# Altium project AtlysAFE.PrjPCB (part 1 of 2)
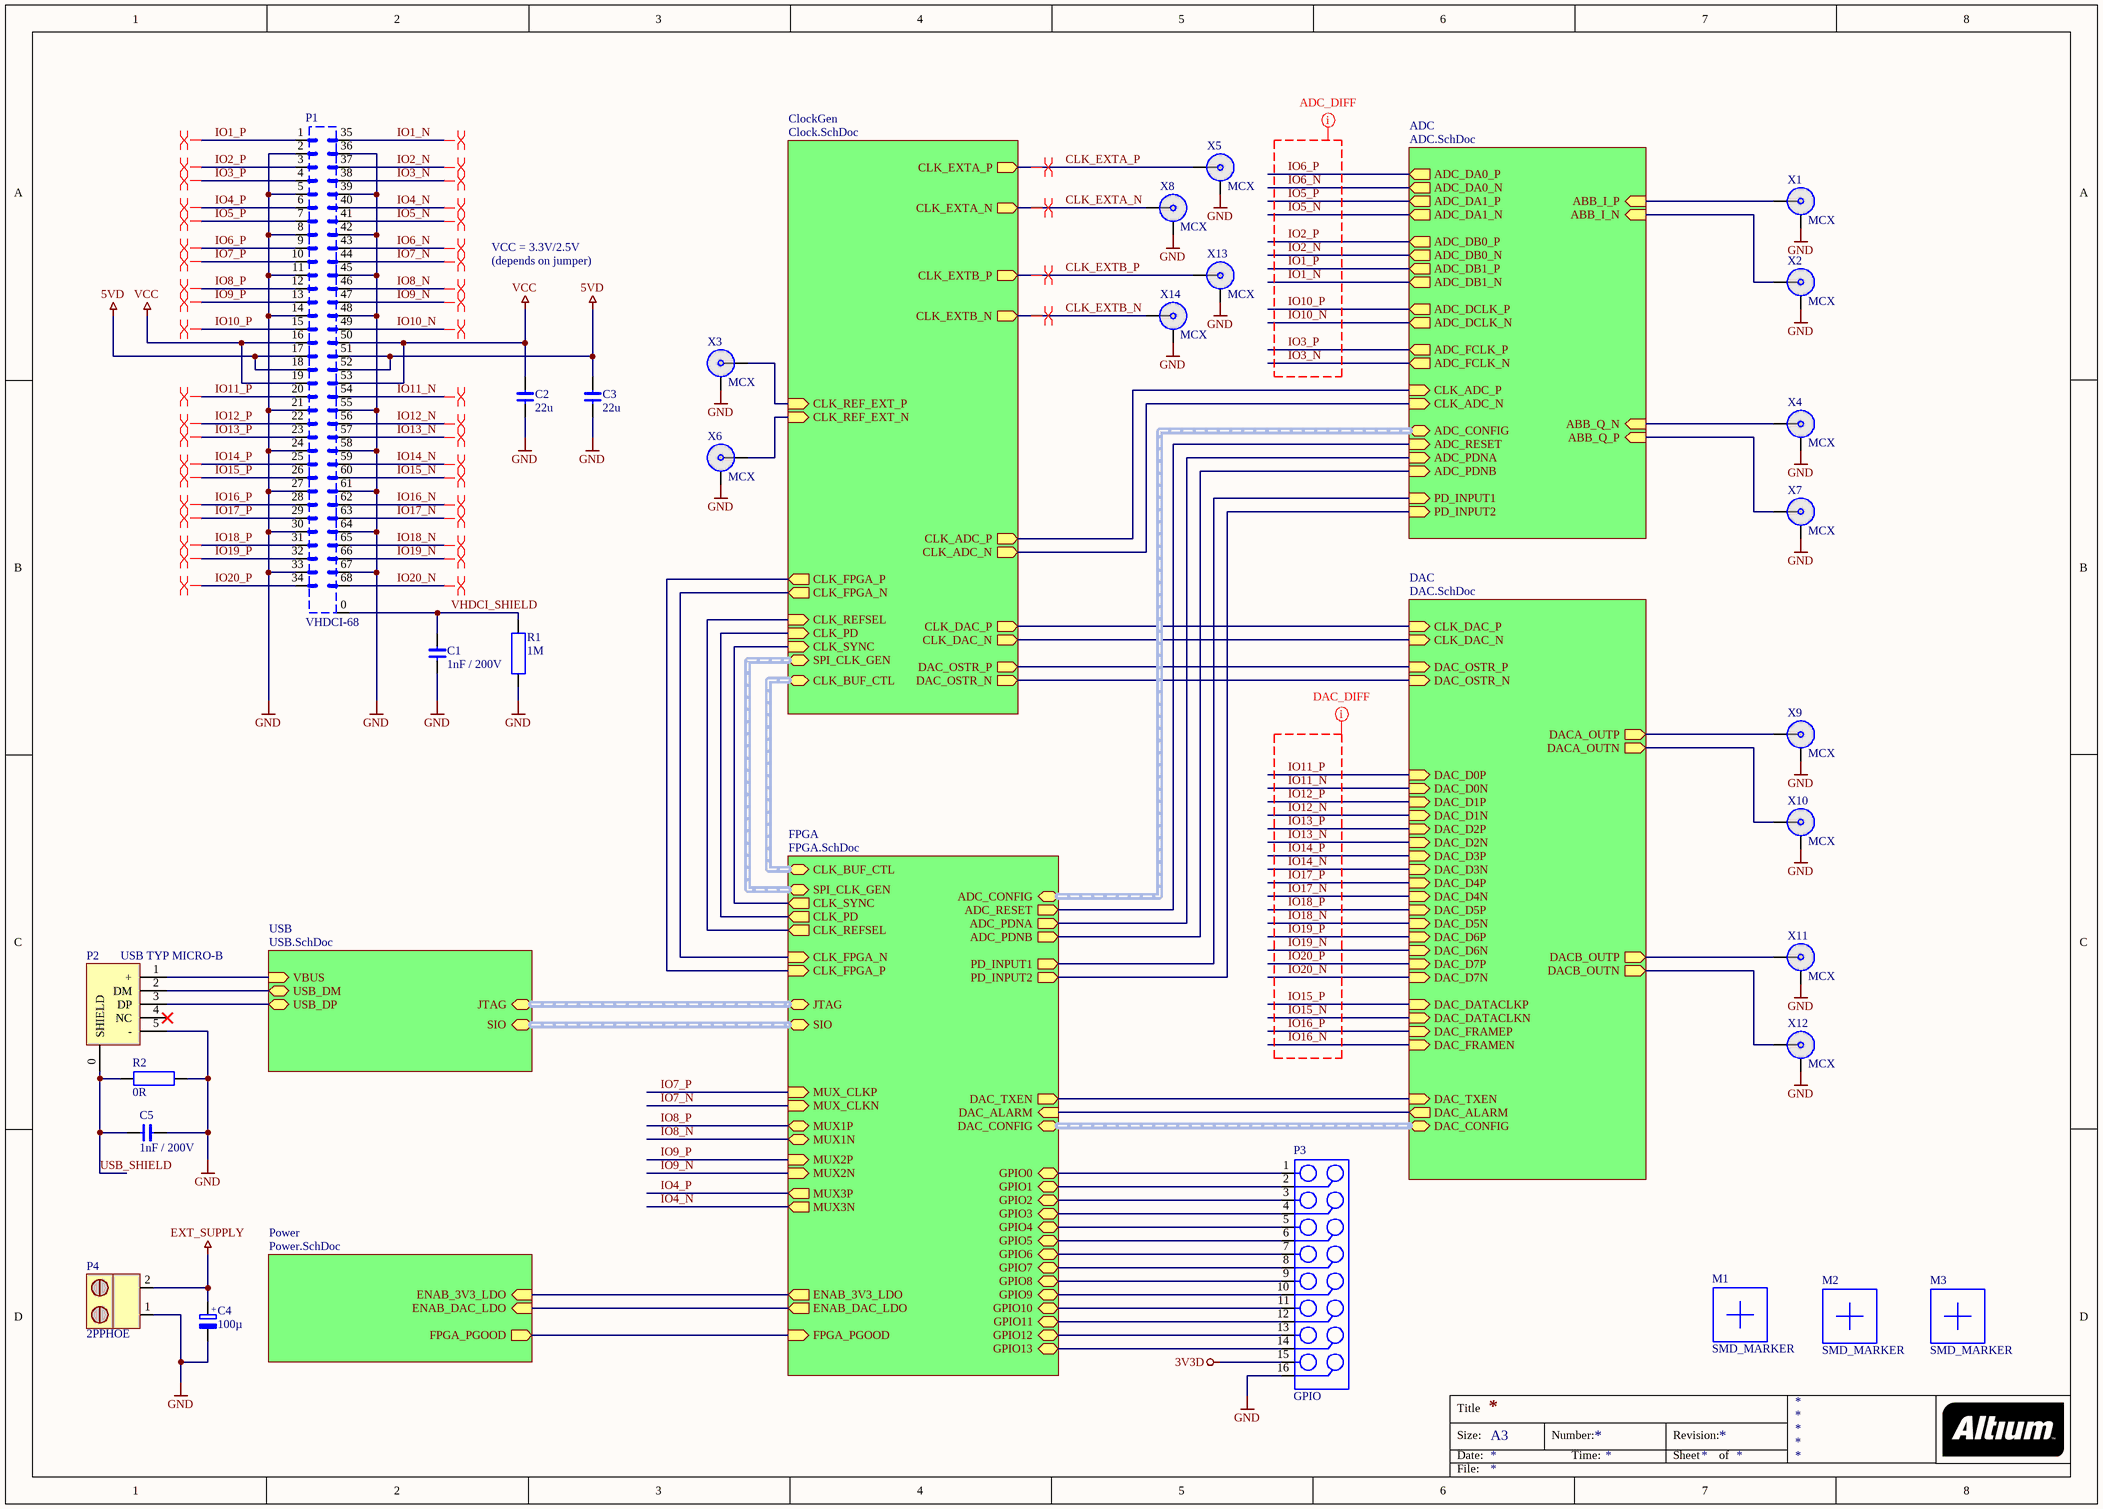
[diagram p0: Main.SchDoc]
8 sheets, 375 parts. Net scope: hierarchical (ports join the sheet entries above them; power ports are global).
Board file: AtlysAFE.PcbDoc
Sheets:
  Main.SchDoc
    ADC = ADC.SchDoc
      ADC_Input = ADC_Input.SchDoc
    DAC = DAC.SchDoc
    FPGA = FPGA.SchDoc
    Power = Power.SchDoc
    USB = USB.SchDoc
    ClockGen = Clock.SchDoc

## Sheet Main.SchDoc
size A3

### Parts
C1  1nF / 200V  [1206]
C2  22u  [1206]
C3  22u  [1206]
C4  100µ  [SMD_ELKO_6.3]
C5  1nF / 200V  [1206]
M1  SMD_MARKER  [SMDMark100 - nopaste]
M2  SMD_MARKER  [SMDMark100 - nopaste]
M3  SMD_MARKER  [SMDMark100 - nopaste]
P1  VHDCI-68  [VHDCI-68_M]
P2  USB TYP MICRO-B  [USB_MICRO_B_SMD_4DIP]
P3  GPIO  [16POL_PF2]
P4  2PPHOE  [2PPHOE]
R1  1M  [1206]
R2  0R  [1206]
X1  MCX  [MCX_TH]
X2  MCX  [MCX_TH]
X3  MCX  [MCX_TH]
X4  MCX  [MCX_TH]
X5  MCX  [MCX_TH]
X6  MCX  [MCX_TH]
X7  MCX  [MCX_TH]
X8  MCX  [MCX_TH]
X9  MCX  [MCX_TH]
X10  MCX  [MCX_TH]
X11  MCX  [MCX_TH]
X12  MCX  [MCX_TH]
X13  MCX  [MCX_TH]
X14  MCX  [MCX_TH]

### Sub-sheets
ADC = ADC.SchDoc: ABB_I_P (in), ABB_I_N (in), ABB_Q_N (in), ABB_Q_P (in), CLK_ADC_P (in), CLK_ADC_N (in), ADC_DA0_P (out), ADC_DA1_P (out), ADC_DB0_P (out), ADC_DB1_P (out), ADC_DCLK_P (out), ADC_FCLK_P (out), ADC_CONFIG (harness SPI3), ADC_RESET (in), ADC_PDNA (in), ADC_PDNB (in), PD_INPUT1 (in), PD_INPUT2 (in), ADC_DA0_N (out), ADC_DA1_N (out), ADC_DB0_N (out), ADC_DB1_N (out), ADC_DCLK_N (out), ADC_FCLK_N (out)
ClockGen = Clock.SchDoc: SPI_CLK_GEN (harness SPI_CLK_GEN), CLK_REFSEL (in), CLK_PD (in), CLK_SYNC (in), CLK_REF_EXT_P (in), CLK_REF_EXT_N (in), CLK_ADC_P (out), CLK_ADC_N (out), CLK_DAC_P (out), CLK_DAC_N (out), DAC_OSTR_P (out), DAC_OSTR_N (out), CLK_FPGA_P (out), CLK_FPGA_N (out), CLK_EXTB_P (out), CLK_EXTB_N (out), CLK_EXTA_P (out), CLK_EXTA_N (out), CLK_BUF_CTL (harness CLK_BUF_CTL)
DAC = DAC.SchDoc: DAC_D0P (in), DAC_D0N (in), DAC_D1P (in), DAC_D1N (in), DAC_D2P (in), DAC_D2N (in), DAC_D3P (in), DAC_D3N (in), DAC_D4P (in), DAC_D4N (in), DAC_D5P (in), DAC_D5N (in), DAC_D6N (in), DAC_D7N (in), DAC_D6P (in), DAC_D7P (in), DAC_DATACLKN (in), DAC_DATACLKP (in), DAC_FRAMEN (in), DAC_FRAMEP (in), DAC_CONFIG (harness SPI3), DAC_TXEN (in), DAC_ALARM (out), DACA_OUTP (out), DACA_OUTN (out), DACB_OUTP (out), DACB_OUTN (out), CLK_DAC_P (in), CLK_DAC_N (in), DAC_OSTR_P (in), DAC_OSTR_N (in)
FPGA = FPGA.SchDoc: JTAG (harness JTAG), SIO (harness Serial IO), ENAB_3V3_LDO (out), FPGA_PGOOD (in), DAC_CONFIG (harness SPI3), DAC_TXEN (out), DAC_ALARM (in), ADC_CONFIG (harness SPI3), ADC_RESET (out), ADC_PDNA (out), ADC_PDNB (out), MUX_CLKP (in), MUX_CLKN (in), MUX2P (in), MUX2N (in), MUX3N (out), MUX3P (out), GPIO0, GPIO1, GPIO2, GPIO3, GPIO4, GPIO5, GPIO6, GPIO7, GPIO8, GPIO9, GPIO10, GPIO11, GPIO12, GPIO13, PD_INPUT1 (out), PD_INPUT2 (out), SPI_CLK_GEN (harness SPI_CLK_GEN), CLK_REFSEL (out), CLK_PD (out), CLK_SYNC (out), CLK_FPGA_P (in), CLK_FPGA_N (in), ENAB_DAC_LDO (out), MUX1N, MUX1P, CLK_BUF_CTL (harness CLK_BUF_CTL)
Power = Power.SchDoc: ENAB_3V3_LDO (in), FPGA_PGOOD (out), ENAB_DAC_LDO (in)
USB = USB.SchDoc: USB_DP (bidir), USB_DM (bidir), JTAG (harness JTAG), SIO (harness Serial IO), VBUS (in)

### Nets
3V3D: P3.15
5VD: C3.1 P1.17 P1.18 P1.51 P1.52
EXT_SUPPLY: C4.1(+) P4.2
GND: C1.2 C2.2 C3.2 C4.2(-) C5.1 P1.2 P1.5 P1.8 P1.11 P1.14 P1.21 P1.24 P1.27 P1.30 P1.33 P1.36 P1.39 P1.42 P1.45 P1.48 P1.55 P1.58 P1.61 P1.64 P1.67 P2.5(-) P3.16 P4.1 R1.2 R2.1 X1.1 X2.1 X3.1 X4.1 X5.1 X6.1 X7.1 X8.1 X9.1 X10.1 X11.1 X12.1 X13.1 X14.1
VCC: C2.1 P1.16 P1.19 P1.50 P1.53
CLK_ADC_N: sheet ADC/CLK_ADC_N, sheet ClockGen/CLK_ADC_N
CLK_ADC_P: sheet ADC/CLK_ADC_P, sheet ClockGen/CLK_ADC_P
CLK_DAC_N: sheet DAC/CLK_DAC_N, sheet ClockGen/CLK_DAC_N
CLK_DAC_P: sheet DAC/CLK_DAC_P, sheet ClockGen/CLK_DAC_P
CLK_EXTA_N: X8.2 ; sheet ClockGen/CLK_EXTA_N
CLK_EXTA_P: X5.2 ; sheet ClockGen/CLK_EXTA_P
CLK_EXTB_N: X14.2 ; sheet ClockGen/CLK_EXTB_N
CLK_EXTB_P: X13.2 ; sheet ClockGen/CLK_EXTB_P
CLK_FPGA_N: sheet FPGA/CLK_FPGA_N, sheet ClockGen/CLK_FPGA_N
CLK_FPGA_P: sheet FPGA/CLK_FPGA_P, sheet ClockGen/CLK_FPGA_P
CLK_REF_EXT_N: X6.2 ; sheet ClockGen/CLK_REF_EXT_N
CLK_REF_EXT_P: X3.2 ; sheet ClockGen/CLK_REF_EXT_P
DAC_OSTR_N: sheet DAC/DAC_OSTR_N, sheet ClockGen/DAC_OSTR_N
DAC_OSTR_P: sheet DAC/DAC_OSTR_P, sheet ClockGen/DAC_OSTR_P
DACA_BIAS_N: X10.2 ; sheet DAC/DACA_OUTN
DACA_BIAS_P: X9.2 ; sheet DAC/DACA_OUTP
DACB_BIAS_N: X12.2 ; sheet DAC/DACB_OUTN
DACB_BIAS_P: X11.2 ; sheet DAC/DACB_OUTP
FPGA_PGOOD: sheet FPGA/FPGA_PGOOD, sheet Power/FPGA_PGOOD
IO1_N: P1.35 ; sheet ADC/ADC_DB1_N
IO1_P: P1.1 ; sheet ADC/ADC_DB1_P
IO2_N: P1.37 ; sheet ADC/ADC_DB0_N
IO2_P: P1.3 ; sheet ADC/ADC_DB0_P
IO3_N: P1.38 ; sheet ADC/ADC_FCLK_N
IO3_P: P1.4 ; sheet ADC/ADC_FCLK_P
IO4_N: P1.40 ; sheet FPGA/MUX3N
IO4_P: P1.6 ; sheet FPGA/MUX3P
IO5_N: P1.41 ; sheet ADC/ADC_DA1_N
IO5_P: P1.7 ; sheet ADC/ADC_DA1_P
IO6_N: P1.43 ; sheet ADC/ADC_DA0_N
IO6_P: P1.9 ; sheet ADC/ADC_DA0_P
IO7_N: P1.44 ; sheet FPGA/MUX_CLKN
IO7_P: P1.10 ; sheet FPGA/MUX_CLKP
IO8_N: P1.46 ; sheet FPGA/MUX1N
IO8_P: P1.12 ; sheet FPGA/MUX1P
IO9_N: P1.47 ; sheet FPGA/MUX2N
IO9_P: P1.13 ; sheet FPGA/MUX2P
IO10_N: P1.49 ; sheet ADC/ADC_DCLK_N
IO10_P: P1.15 ; sheet ADC/ADC_DCLK_P
IO11_N: P1.54 ; sheet DAC/DAC_D0N
IO11_P: P1.20 ; sheet DAC/DAC_D0P
IO12_N: P1.56 ; sheet DAC/DAC_D1N
IO12_P: P1.22 ; sheet DAC/DAC_D1P
IO13_N: P1.57 ; sheet DAC/DAC_D2N
IO13_P: P1.23 ; sheet DAC/DAC_D2P
IO14_N: P1.59 ; sheet DAC/DAC_D3N
IO14_P: P1.25 ; sheet DAC/DAC_D3P
IO15_N: P1.60 ; sheet DAC/DAC_DATACLKN
IO15_P: P1.26 ; sheet DAC/DAC_DATACLKP
IO16_N: P1.62 ; sheet DAC/DAC_FRAMEN
IO16_P: P1.28 ; sheet DAC/DAC_FRAMEP
IO17_N: P1.63 ; sheet DAC/DAC_D4N
IO17_P: P1.29 ; sheet DAC/DAC_D4P
IO18_N: P1.65 ; sheet DAC/DAC_D5N
IO18_P: P1.31 ; sheet DAC/DAC_D5P
IO19_N: P1.66 ; sheet DAC/DAC_D6N
IO19_P: P1.32 ; sheet DAC/DAC_D6P
IO20_N: P1.68 ; sheet DAC/DAC_D7N
IO20_P: P1.34 ; sheet DAC/DAC_D7P
USB_D_N: P2.2(DM) ; sheet USB/USB_DM
USB_D_P: P2.3(DP) ; sheet USB/USB_DP
USB_SHIELD: C5.2 P2.0(SHIELD) R2.2
USB_VBUS: P2.1(+) ; sheet USB/VBUS
VHDCI_SHIELD: C1.1 P1.0(SHIELD) R1.1
NetIC100_4: sheet ADC/ADC_RESET, sheet FPGA/ADC_RESET
NetIC100_30: sheet ADC/ADC_PDNB, sheet FPGA/ADC_PDNB
NetIC100_31: sheet ADC/ADC_PDNA, sheet FPGA/ADC_PDNA
NetIC200_12: sheet ADC/PD_INPUT1, sheet FPGA/PD_INPUT1
NetIC201_12: sheet ADC/PD_INPUT2, sheet FPGA/PD_INPUT2
NetIC300_30: sheet DAC/DAC_TXEN, sheet FPGA/DAC_TXEN
NetIC400_13: sheet DAC/DAC_ALARM, sheet FPGA/DAC_ALARM
NetIC400_29: sheet FPGA/CLK_SYNC, sheet ClockGen/CLK_SYNC
NetIC400_30: sheet FPGA/CLK_REFSEL, sheet ClockGen/CLK_REFSEL
NetIC400_31: sheet FPGA/CLK_PD, sheet ClockGen/CLK_PD
NetIC400_51: P3.14 ; sheet FPGA/GPIO13
NetIC400_52: P3.13 ; sheet FPGA/GPIO12
NetIC400_53: P3.12 ; sheet FPGA/GPIO11
NetIC400_54: P3.11 ; sheet FPGA/GPIO10
NetIC400_57: P3.10 ; sheet FPGA/GPIO9
NetIC400_58: P3.9 ; sheet FPGA/GPIO8
NetIC400_59: P3.8 ; sheet FPGA/GPIO7
NetIC400_60: P3.7 ; sheet FPGA/GPIO6
NetIC400_62: P3.6 ; sheet FPGA/GPIO5
NetIC400_63: P3.5 ; sheet FPGA/GPIO4
NetIC400_64: P3.4 ; sheet FPGA/GPIO3
NetIC400_65: P3.3 ; sheet FPGA/GPIO2
NetIC400_66: P3.2 ; sheet FPGA/GPIO1
NetIC400_67: P3.1 ; sheet FPGA/GPIO0
NetIC400_71: sheet FPGA/ENAB_DAC_LDO, sheet Power/ENAB_DAC_LDO
NetIC400_75: sheet FPGA/ENAB_3V3_LDO, sheet Power/ENAB_3V3_LDO
NetR203_1: X1.2 ; sheet ADC/ABB_I_P
NetR207_1: X2.2 ; sheet ADC/ABB_I_N
NetR218_1: X7.2 ; sheet ADC/ABB_Q_P
NetR222_1: X4.2 ; sheet ADC/ABB_Q_N

Not connected (* = marked no-connect by the designer): P2 4(NC)*

### Buses and harness runs
harness sheet ADC/ADC_CONFIG = sheet FPGA/ADC_CONFIG
harness sheet ClockGen/CLK_BUF_CTL = sheet FPGA/CLK_BUF_CTL
harness sheet ClockGen/SPI_CLK_GEN = sheet FPGA/SPI_CLK_GEN
harness sheet DAC/DAC_CONFIG = sheet FPGA/DAC_CONFIG
harness sheet FPGA/JTAG = sheet USB/JTAG
harness sheet FPGA/SIO = sheet USB/SIO

### Layout directives
differential pair: CLK_EXTA_N, CLK_EXTA_P, CLK_EXTB_N, CLK_EXTB_P, IO1_N, IO1_P, IO2_N, IO2_P, IO3_N, IO3_P, IO4_N, IO4_P, IO5_N, IO5_P, IO6_N, IO6_P, IO7_N, IO7_P, IO8_N, IO8_P, IO9_N, IO9_P, IO10_N, IO10_P, IO11_N, IO11_P, IO12_N, IO12_P, IO13_N, IO13_P, IO14_N, IO14_P, IO15_N, IO15_P, IO16_N, IO16_P, IO17_N, IO17_P, IO18_N, IO18_P, IO19_N, IO19_P, IO20_N, IO20_P
net class DAC_DIFF: IO11_N, IO11_P, IO12_N, IO12_P, IO13_N, IO13_P, IO14_N, IO14_P, IO15_N, IO15_P, IO16_N, IO16_P, IO17_N, IO17_P, IO18_N, IO18_P, IO19_N, IO19_P, IO20_N, IO20_P
net class ADC_DIFF: IO1_N, IO1_P, IO2_N, IO2_P, IO3_N, IO3_P, IO5_N, IO5_P, IO6_N, IO6_P, IO10_N, IO10_P

### Notes on the sheet
- VCC = 3.3V/2.5V
- (depends on jumper)
- Title
- Size:
- Date:
- A3
- Number:
- Time:
- Revision:
- Sheet
- of
- File:

### Library data of the parts
C1-C3 C5 = C
C4 = ELCO: EEH-ZA1E101XP
M1-M3 = SMD_MARKER: SMD MARKER
P1 = MALE_VHDCI-68: 68-Pin VHDCI Connector
P2 = USB TYP MICRO-B: 10118194-0001LF
P3 = 16POLPF
P4 = 2PPHOE: Steckbare Scharubklemme 2pol.
R1 R2 = R
X1-X14 = MCX: MCX Connector

## Sheet ADC.SchDoc
size A3
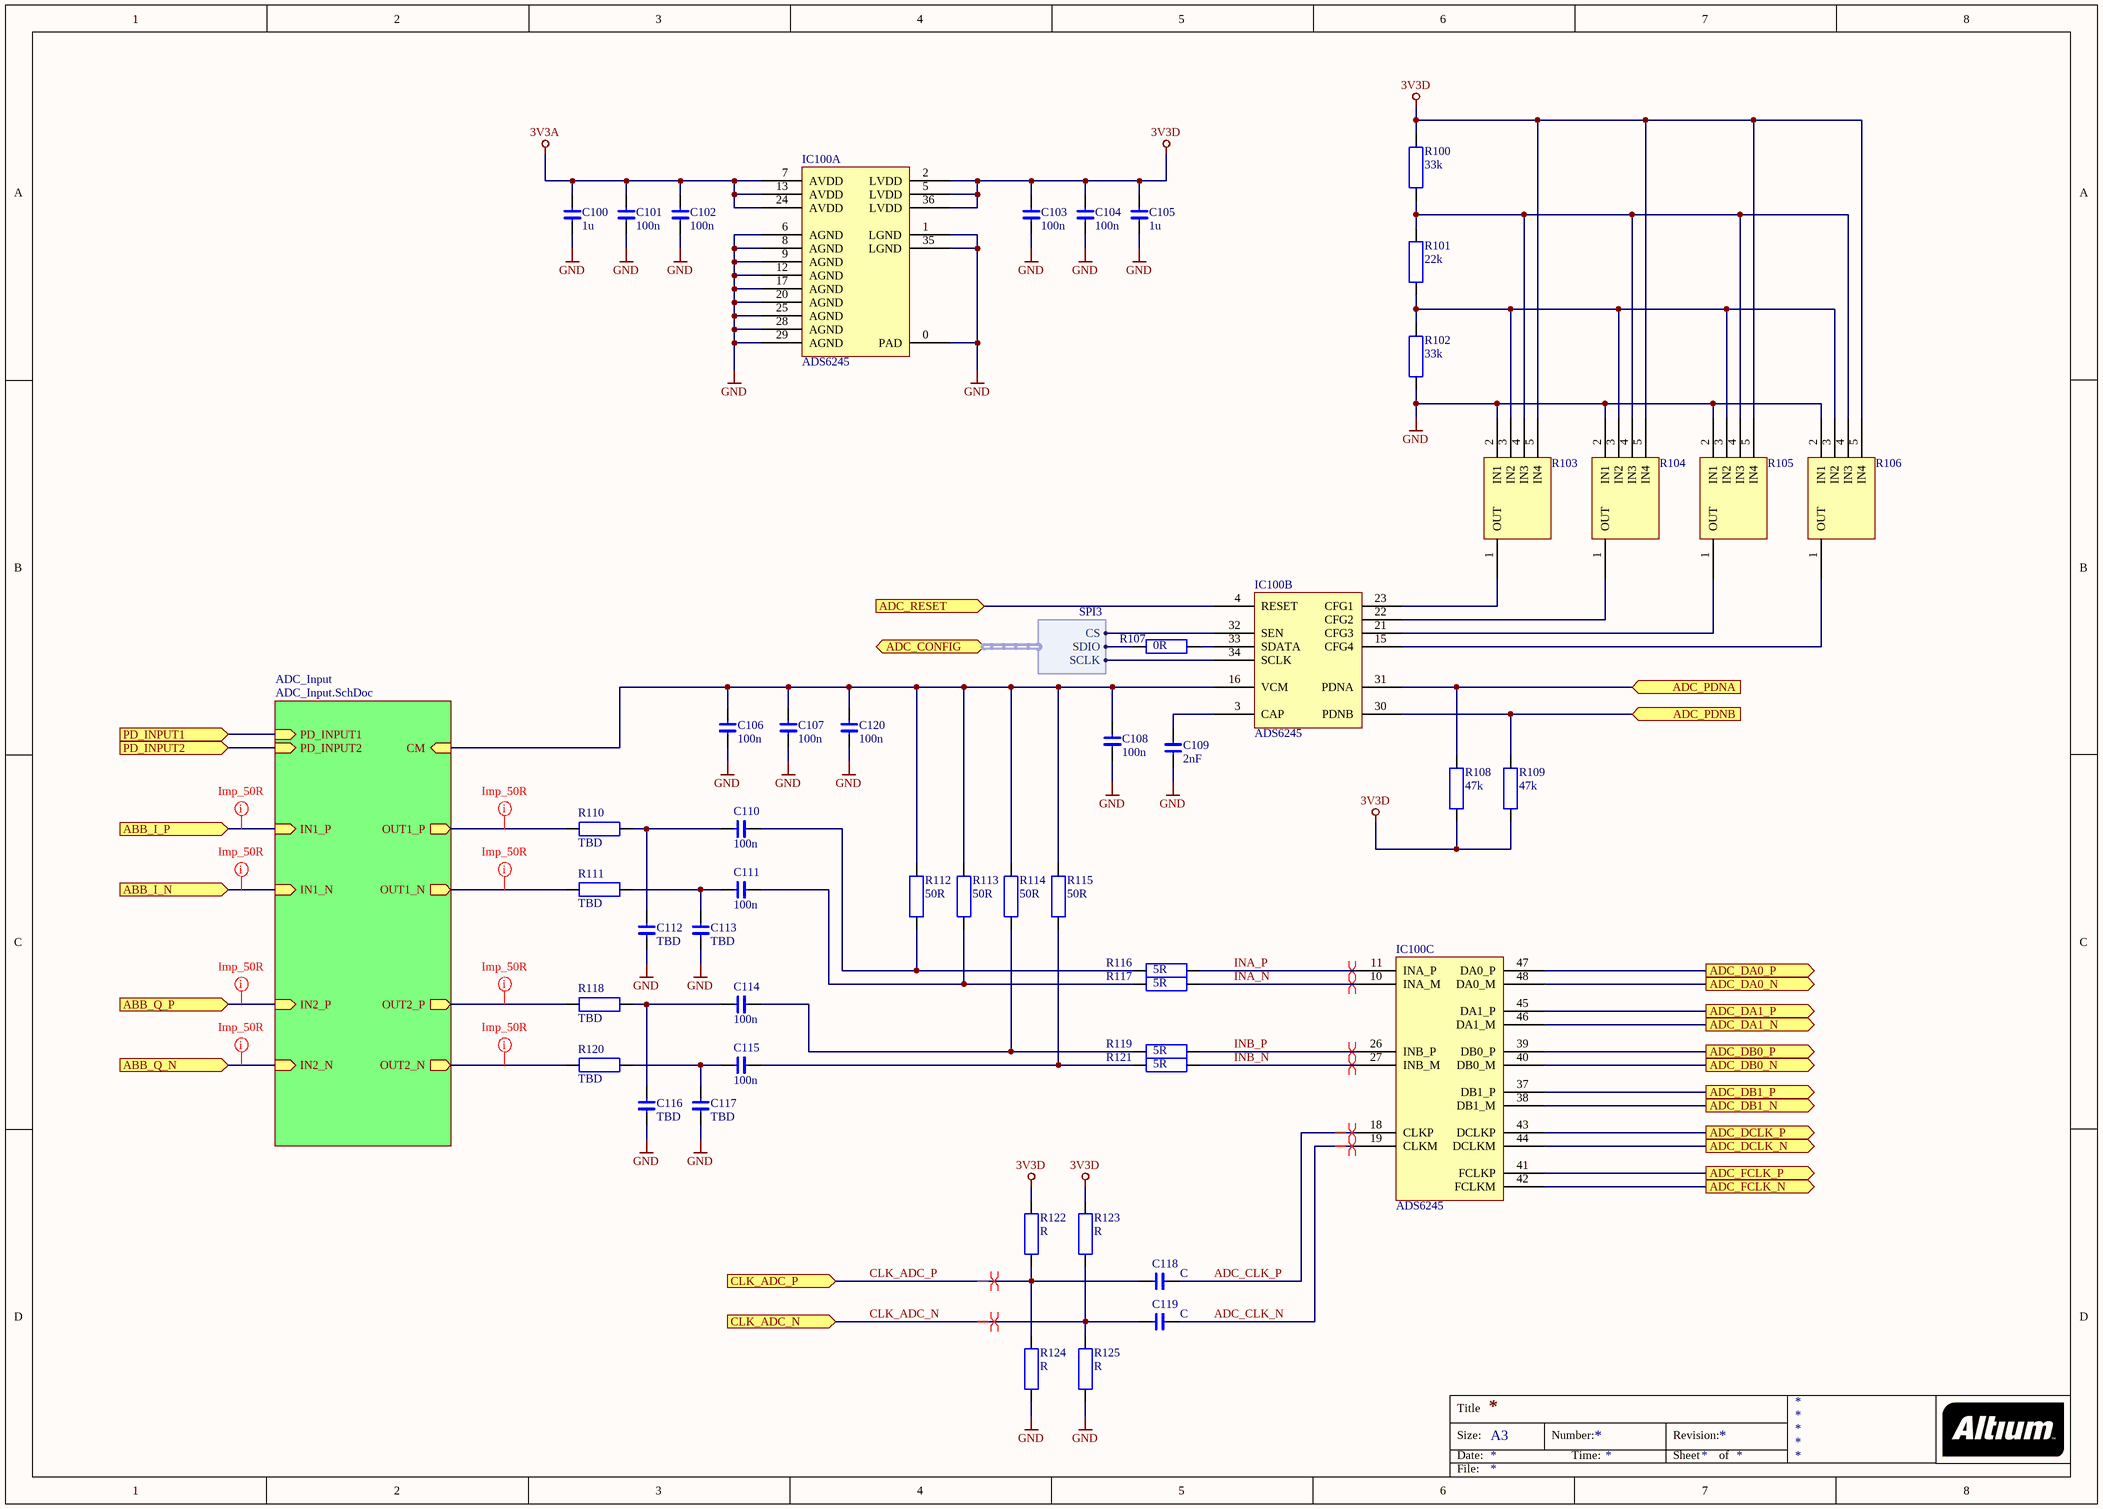
[diagram p1: ADC.SchDoc]

### Parts
C100  1u  [0603 SMALL OUTLINE]
C101  100n  [0603 SMALL OUTLINE]
C102  100n  [0603 SMALL OUTLINE]
C103  100n  [0603 SMALL OUTLINE]
C104  100n  [0603 SMALL OUTLINE]
C105  1u  [0603 SMALL OUTLINE]
C106  100n  [0603 SMALL OUTLINE]
C107  100n  [0603 SMALL OUTLINE]
C108  100n  [0603 SMALL OUTLINE]
C109  2nF  [0603 SMALL OUTLINE]
C110  100n  [0603 SMALL OUTLINE]
C111  100n  [0603 SMALL OUTLINE]
C112  TBD  [0603 SMALL OUTLINE]
C113  TBD  [0603 SMALL OUTLINE]
C114  100n  [0603 SMALL OUTLINE]
C115  100n  [0603 SMALL OUTLINE]
C116  TBD  [0603 SMALL OUTLINE]
C117  TBD  [0603 SMALL OUTLINE]
C118  C  [0603 SMALL OUTLINE]
C119  C  [0603 SMALL OUTLINE]
C120  100n  [0603 SMALL OUTLINE]
IC100  ADS6245  [VQFN48_LONG]  (parts A,B,C of 3)
R100  33k  [0603 SMALL OUTLINE]
R101  22k  [0603 SMALL OUTLINE]
R102  33k  [0603 SMALL OUTLINE]
R103  0603_MUX4  [0603_MUX4]  (value not drawn)
R104  0603_MUX4  [0603_MUX4]  (value not drawn)
R105  0603_MUX4  [0603_MUX4]  (value not drawn)
R106  0603_MUX4  [0603_MUX4]  (value not drawn)
R107  0R  [0603 SMALL OUTLINE]
R108  47k  [0603 SMALL OUTLINE]
R109  47k  [0603 SMALL OUTLINE]
R110  TBD  [0603 SMALL OUTLINE]
R111  TBD  [0603 SMALL OUTLINE]
R112  50R  [0603 SMALL OUTLINE]
R113  50R  [0603 SMALL OUTLINE]
R114  50R  [0603 SMALL OUTLINE]
R115  50R  [0603 SMALL OUTLINE]
R116  5R  [0603 SMALL OUTLINE]
R117  5R  [0603 SMALL OUTLINE]
R118  TBD  [0603 SMALL OUTLINE]
R119  5R  [0603 SMALL OUTLINE]
R120  TBD  [0603 SMALL OUTLINE]
R121  5R  [0603 SMALL OUTLINE]
R122  R  [0603 SMALL OUTLINE]
R123  R  [0603 SMALL OUTLINE]
R124  R  [0603 SMALL OUTLINE]
R125  R  [0603 SMALL OUTLINE]

### Sub-sheets
ADC_Input = ADC_Input.SchDoc: CM (in), IN1_P (in), IN1_N (in), OUT1_P (out), OUT1_N (out), IN2_P (in), IN2_N (in), OUT2_P (out), OUT2_N (out), PD_INPUT1 (in), PD_INPUT2 (in)

### Ports
ABB_I_N (in), ABB_I_P (in), ABB_Q_N (in), ABB_Q_P (in), ADC_CONFIG (harness SPI3), ADC_DA0_N (out), ADC_DA0_P (out), ADC_DA1_N (out), ADC_DA1_P (out), ADC_DB0_N (out), ADC_DB0_P (out), ADC_DB1_N (out), ADC_DB1_P (out), ADC_DCLK_N (out), ADC_DCLK_P (out), ADC_FCLK_N (out), ADC_FCLK_P (out), ADC_PDNA (in), ADC_PDNB (in), ADC_RESET (in), CLK_ADC_N (in), CLK_ADC_P (in), PD_INPUT1 (in), PD_INPUT2 (in)

### Harnesses
SPI3: CS, SCLK, SDIO

### Nets
3V3A: C100.1 C101.1 C102.1 IC100.7(AVDD) IC100.13(AVDD) IC100.24(AVDD)
3V3D: C103.1 C104.1 C105.1 IC100.2(LVDD) IC100.5(LVDD) IC100.36(LVDD) R100.2 R103.5(IN4) R104.5(IN4) R105.5(IN4) R106.5(IN4) R108.1 R109.1 R122.1 R123.1
GND: C100.2 C101.2 C102.2 C103.2 C104.2 C105.2 C106.2 C107.2 C108.2 C109.2 C112.2 C113.2 C116.2 C117.2 C120.2 IC100.0(PAD) IC100.1(LGND) IC100.6(AGND) IC100.8(AGND) IC100.9(AGND) IC100.12(AGND) IC100.17(AGND) IC100.20(AGND) IC100.25(AGND) IC100.28(AGND) IC100.29(AGND) IC100.35(LGND) R102.1 R103.2(IN1) R104.2(IN1) R105.2(IN1) R106.2(IN1) R124.2 R125.2
ADC_CLK_N: C119.2 IC100.19(CLKM)
ADC_CLK_P: C118.2 IC100.18(CLKP)
CLK_ADC_N: C119.1 R123.2 R125.1 ; port CLK_ADC_N
CLK_ADC_P: C118.1 R122.2 R124.1 ; port CLK_ADC_P
INA_N: IC100.10(INA_M) R117.2
INA_P: IC100.11(INA_P) R116.2
INB_N: IC100.27(INB_M) R121.2
INB_P: IC100.26(INB_P) R119.2
IO1_N: IC100.38(DB1_M) ; port ADC_DB1_N
IO1_P: IC100.37(DB1_P) ; port ADC_DB1_P
IO2_N: IC100.40(DB0_M) ; port ADC_DB0_N
IO2_P: IC100.39(DB0_P) ; port ADC_DB0_P
IO3_N: IC100.42(FCLKM) ; port ADC_FCLK_N
IO3_P: IC100.41(FCLKP) ; port ADC_FCLK_P
IO5_N: IC100.46(DA1_M) ; port ADC_DA1_N
IO5_P: IC100.45(DA1_P) ; port ADC_DA1_P
IO6_N: IC100.48(DA0_M) ; port ADC_DA0_N
IO6_P: IC100.47(DA0_P) ; port ADC_DA0_P
IO10_N: IC100.44(DCLKM) ; port ADC_DCLK_N
IO10_P: IC100.43(DCLKP) ; port ADC_DCLK_P
NetC106_1: C106.1 C107.1 C108.1 C120.1 IC100.16(VCM) R112.1 R113.1 R114.1 R115.1 ; sheet ADC_Input/CM
NetC109_1: C109.1 IC100.3(CAP)
NetC110_1: C110.1 R112.2 R116.1
NetC110_2: C110.2 C112.1 R110.1
NetC111_1: C111.1 R113.2 R117.1
NetC111_2: C111.2 C113.1 R111.1
NetC114_1: C114.1 R114.2 R119.1
NetC114_2: C114.2 C116.1 R118.1
NetC115_1: C115.1 R115.2 R121.1
NetC115_2: C115.2 C117.1 R120.1
NetIC100_4: IC100.4(RESET) ; port ADC_RESET
NetIC100_15: IC100.15(CFG4) R106.1(OUT)
NetIC100_21: IC100.21(CFG3) R105.1(OUT)
NetIC100_22: IC100.22(CFG2) R104.1(OUT)
NetIC100_23: IC100.23(CFG1) R103.1(OUT)
NetIC100_30: IC100.30(PDNB) R109.2 ; port ADC_PDNB
NetIC100_31: IC100.31(PDNA) R108.2 ; port ADC_PDNA
NetIC100_32: IC100.32(SEN) ; port ADC_CONFIG.CS
NetIC100_33: IC100.33(SDATA) R107.2
NetIC100_34: IC100.34(SCLK) ; port ADC_CONFIG.SCLK
NetIC200_3: R110.2 ; sheet ADC_Input/OUT1_P
NetIC200_10: R111.2 ; sheet ADC_Input/OUT1_N
NetIC200_12: port PD_INPUT1, sheet ADC_Input/PD_INPUT1
NetIC201_3: R118.2 ; sheet ADC_Input/OUT2_P
NetIC201_10: R120.2 ; sheet ADC_Input/OUT2_N
NetIC201_12: port PD_INPUT2, sheet ADC_Input/PD_INPUT2
NetIC400_19: R107.1 ; port ADC_CONFIG.SDIO
NetR100_1: R100.1 R101.2 R103.4(IN3) R104.4(IN3) R105.4(IN3) R106.4(IN3)
NetR101_1: R101.1 R102.2 R103.3(IN2) R104.3(IN2) R105.3(IN2) R106.3(IN2)
NetR203_1: port ABB_I_P, sheet ADC_Input/IN1_P
NetR207_1: port ABB_I_N, sheet ADC_Input/IN1_N
NetR218_1: port ABB_Q_P, sheet ADC_Input/IN2_P
NetR222_1: port ABB_Q_N, sheet ADC_Input/IN2_N

### Layout directives
differential pair: ADC_CLK_N, ADC_CLK_P, CLK_ADC_N, CLK_ADC_P, INA_N, INA_P, INB_N, INB_P
net class Imp_50R: NetIC200_3, NetIC200_10, NetIC201_3, NetIC201_10, NetR203_1, NetR207_1, NetR218_1, NetR222_1

### Notes on the sheet
- Title
- Size:
- Date:
- A3
- Number:
- Time:
- Revision:
- Sheet
- of
- File:

### Library data of the parts
C100-C117 C120 = C
IC100 = ADS6245_2WIRE: DUAL CHANNEL, 14-BIT, 125/105/80/65 MSPS ADC WITH SERIAL LVDS OUTPUTS
R100-R102 R107-R121 = R

## Sheet ADC_Input.SchDoc
size A3
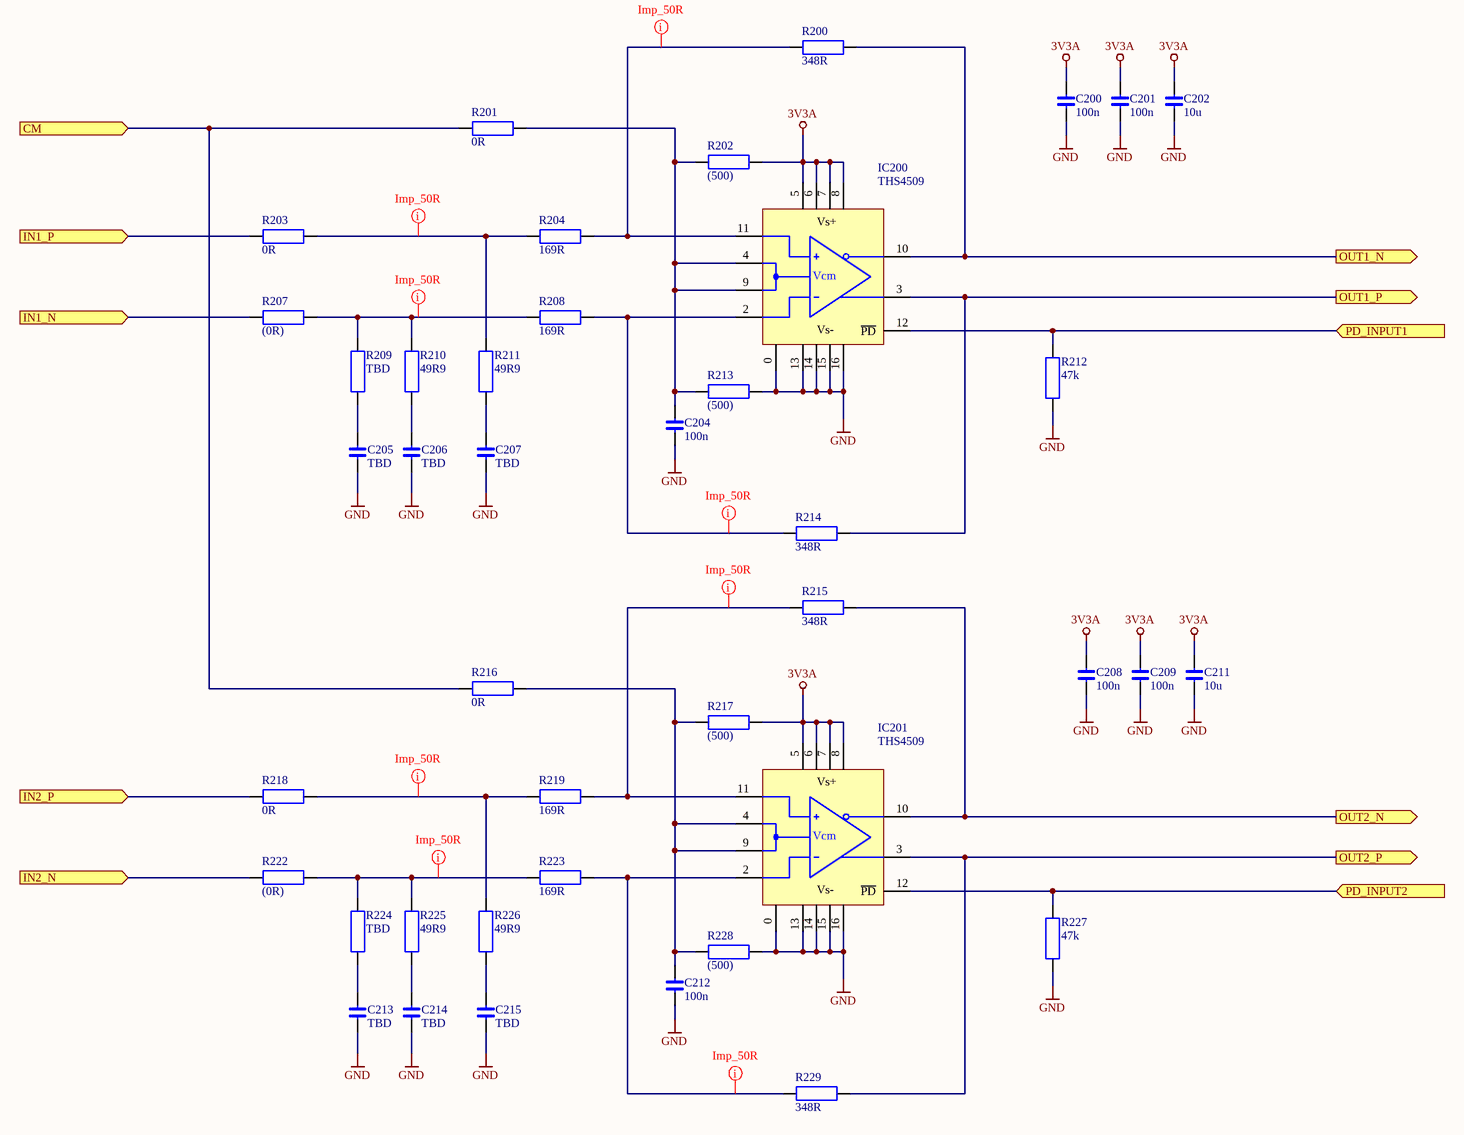
[diagram p2: ADC_Input.SchDoc]

### Parts
C200  100n  [0603 SMALL OUTLINE]
C201  100n  [0603 SMALL OUTLINE]
C202  10u  [0805 SMALL OUTLINE]
C204  100n  [0603 SMALL OUTLINE]
C205  TBD  [0603 SMALL OUTLINE]
C206  TBD  [0603 SMALL OUTLINE]
C207  TBD  [0603 SMALL OUTLINE]
C208  100n  [0603 SMALL OUTLINE]
C209  100n  [0603 SMALL OUTLINE]
C211  10u  [0805 SMALL OUTLINE]
C212  100n  [0603 SMALL OUTLINE]
C213  TBD  [0603 SMALL OUTLINE]
C214  TBD  [0603 SMALL OUTLINE]
C215  TBD  [0603 SMALL OUTLINE]
IC200  THS4509  [QFN16_LONG]
IC201  THS4509  [QFN16_LONG]
R200  348R  [0603 SMALL OUTLINE]
R201  0R  [0603 SMALL OUTLINE]
R202  (500)  [0603 SMALL OUTLINE]
R203  0R  [0603 SMALL OUTLINE]
R204  169R  [0603 SMALL OUTLINE]
R207  (0R)  [0603 SMALL OUTLINE]
R208  169R  [0603 SMALL OUTLINE]
R209  TBD  [0603 SMALL OUTLINE]
R210  49R9  [0603 SMALL OUTLINE]
R211  49R9  [0603 SMALL OUTLINE]
R212  47k  [0603 SMALL OUTLINE]
R213  (500)  [0603 SMALL OUTLINE]
R214  348R  [0603 SMALL OUTLINE]
R215  348R  [0603 SMALL OUTLINE]
R216  0R  [0603 SMALL OUTLINE]
R217  (500)  [0603 SMALL OUTLINE]
R218  0R  [0603 SMALL OUTLINE]
R219  169R  [0603 SMALL OUTLINE]
R222  (0R)  [0603 SMALL OUTLINE]
R223  169R  [0603 SMALL OUTLINE]
R224  TBD  [0603 SMALL OUTLINE]
R225  49R9  [0603 SMALL OUTLINE]
R226  49R9  [0603 SMALL OUTLINE]
R227  47k  [0603 SMALL OUTLINE]
R228  (500)  [0603 SMALL OUTLINE]
R229  348R  [0603 SMALL OUTLINE]

### Ports
CM (in), IN1_N (in), IN1_P (in), IN2_N (in), IN2_P (in), OUT1_N (out), OUT1_P (out), OUT2_N (out), OUT2_P (out), PD_INPUT1 (in), PD_INPUT2 (in)

### Nets
3V3A: C200.1 C201.1 C202.1 C208.1 C209.1 C211.1 IC200.5(Vs+) IC200.6(Vs+) IC200.7(Vs+) IC200.8(Vs+) IC201.5(Vs+) IC201.6(Vs+) IC201.7(Vs+) IC201.8(Vs+) R202.1 R217.1
GND: C200.2 C201.2 C202.2 C204.2 C205.2 C206.2 C207.2 C208.2 C209.2 C211.2 C212.2 C213.2 C214.2 C215.2 IC200.0(PAD) IC200.13(Vs-) IC200.14(Vs-) IC200.15(Vs-) IC200.16(Vs-) IC201.0(PAD) IC201.13(Vs-) IC201.14(Vs-) IC201.15(Vs-) IC201.16(Vs-) R212.1 R213.1 R227.1 R228.1
NetC106_1: R201.1 R216.1 ; port CM
NetC204_1: C204.1 IC200.4(CM) IC200.9(CM) R201.2 R202.2 R213.2
NetC205_1: C205.1 R209.1
NetC206_1: C206.1 R210.1
NetC207_1: C207.1 R211.1
NetC212_1: C212.1 IC201.4(CM) IC201.9(CM) R216.2 R217.2 R228.2
NetC213_1: C213.1 R224.1
NetC214_1: C214.1 R225.1
NetC215_1: C215.1 R226.1
NetIC200_2: IC200.2(-IN) R208.1 R214.2
NetIC200_3: IC200.3(+OUT) R214.1 ; port OUT1_P
NetIC200_10: IC200.10(-OUT) R200.1 ; port OUT1_N
NetIC200_11: IC200.11(+IN) R200.2 R204.1
NetIC200_12: IC200.12(~{PD}) R212.2 ; port PD_INPUT1
NetIC201_2: IC201.2(-IN) R223.1 R229.2
NetIC201_3: IC201.3(+OUT) R229.1 ; port OUT2_P
NetIC201_10: IC201.10(-OUT) R215.1 ; port OUT2_N
NetIC201_11: IC201.11(+IN) R215.2 R219.1
NetIC201_12: IC201.12(~{PD}) R227.2 ; port PD_INPUT2
NetR203_1: R203.1 ; port IN1_P
NetR203_2: R203.2 R204.2 R211.2
NetR207_1: R207.1 ; port IN1_N
NetR207_2: R207.2 R208.2 R209.2 R210.2
NetR218_1: R218.1 ; port IN2_P
NetR218_2: R218.2 R219.2 R226.2
NetR222_1: R222.1 ; port IN2_N
NetR222_2: R222.2 R223.2 R224.2 R225.2

### Layout directives
net class Imp_50R: NetIC200_2, NetIC200_11, NetIC201_2, NetIC201_11, NetR203_2, NetR207_2, NetR218_2, NetR222_2

### Notes on the sheet
- Title
- Size:
- Date:
- A3
- Number:
- Time:
- Revision:
- Sheet
- of
- File:
- (in symbol THS4509) Vcm

### Library data of the parts
C200-C202 C204-C209 C211-C215 = C
IC200 IC201 = THS4509: WIDEBAND, LOW-NOISE, LOW-DISTORTION, FULLY-DIFFERENTIAL AMPLIFIER
R200-R204 R207-R219 R222-R229 = R

## Sheet DAC.SchDoc
size A3
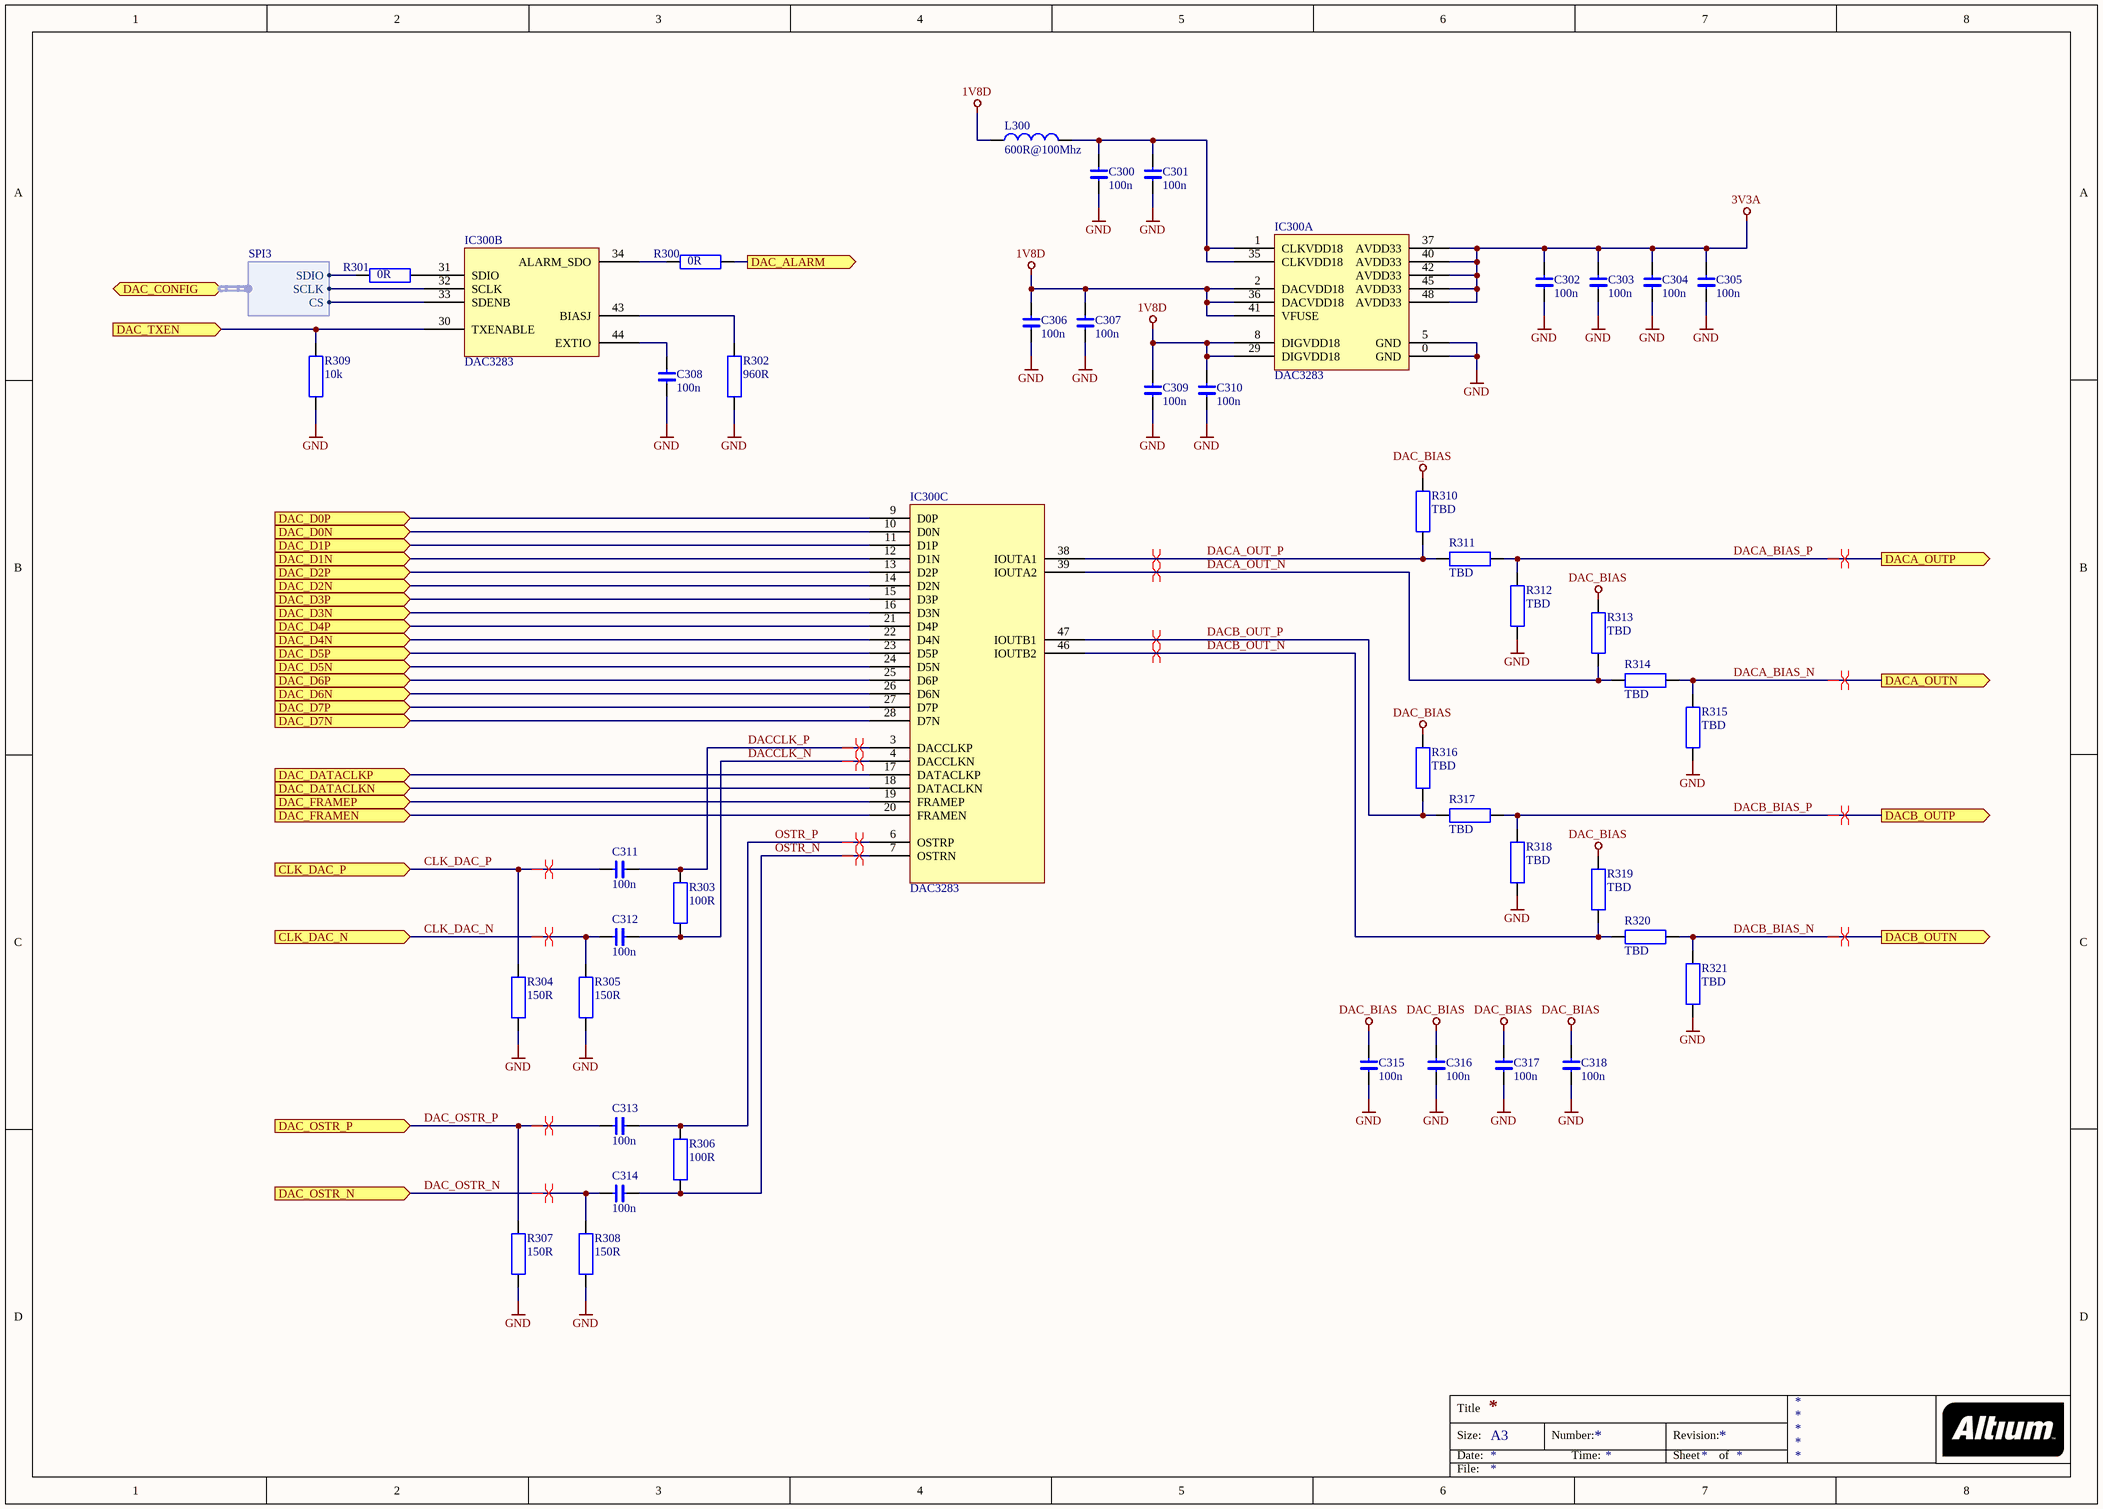
[diagram p3: DAC.SchDoc]

### Parts
C300  100n  [0603 SMALL OUTLINE]
C301  100n  [0603 SMALL OUTLINE]
C302  100n  [0603 SMALL OUTLINE]
C303  100n  [0603 SMALL OUTLINE]
C304  100n  [0603 SMALL OUTLINE]
C305  100n  [0603 SMALL OUTLINE]
C306  100n  [0603 SMALL OUTLINE]
C307  100n  [0603 SMALL OUTLINE]
C308  100n  [0603 SMALL OUTLINE]
C309  100n  [0603 SMALL OUTLINE]
C310  100n  [0603 SMALL OUTLINE]
C311  100n  [0603 SMALL OUTLINE]
C312  100n  [0603 SMALL OUTLINE]
C313  100n  [0603 SMALL OUTLINE]
C314  100n  [0603 SMALL OUTLINE]
C315  100n  [0603 SMALL OUTLINE]
C316  100n  [0603 SMALL OUTLINE]
C317  100n  [0603 SMALL OUTLINE]
C318  100n  [0603 SMALL OUTLINE]
IC300  DAC3283  [VQFN48_LONG]  (parts A,B,C of 3)
L300  600R@100Mhz  [0805]
R300  0R  [0603 SMALL OUTLINE]
R301  0R  [0603 SMALL OUTLINE]
R302  960R  [0603 SMALL OUTLINE]
R303  100R  [0603 SMALL OUTLINE]
R304  150R  [0603 SMALL OUTLINE]
R305  150R  [0603 SMALL OUTLINE]
R306  100R  [0603 SMALL OUTLINE]
R307  150R  [0603 SMALL OUTLINE]
R308  150R  [0603 SMALL OUTLINE]
R309  10k  [0603 SMALL OUTLINE]
R310  TBD  [0603 SMALL OUTLINE]
R311  TBD  [0603 SMALL OUTLINE]
R312  TBD  [0603 SMALL OUTLINE]
R313  TBD  [0603 SMALL OUTLINE]
R314  TBD  [0603 SMALL OUTLINE]
R315  TBD  [0603 SMALL OUTLINE]
R316  TBD  [0603 SMALL OUTLINE]
R317  TBD  [0603 SMALL OUTLINE]
R318  TBD  [0603 SMALL OUTLINE]
R319  TBD  [0603 SMALL OUTLINE]
R320  TBD  [0603 SMALL OUTLINE]
R321  TBD  [0603 SMALL OUTLINE]

### Ports
CLK_DAC_N (in), CLK_DAC_P (in), DAC_ALARM (out), DAC_CONFIG (harness SPI3), DAC_D0N (in), DAC_D0P (in), DAC_D1N (in), DAC_D1P (in), DAC_D2N (in), DAC_D2P (in), DAC_D3N (in), DAC_D3P (in), DAC_D4N (in), DAC_D4P (in), DAC_D5N (in), DAC_D5P (in), DAC_D6N (in), DAC_D6P (in), DAC_D7N (in), DAC_D7P (in), DAC_DATACLKN (in), DAC_DATACLKP (in), DAC_FRAMEN (in), DAC_FRAMEP (in), DAC_OSTR_N (in), DAC_OSTR_P (in), DAC_TXEN (in), DACA_OUTN (out), DACA_OUTP (out), DACB_OUTN (out), DACB_OUTP (out)

### Harnesses
SPI3: SDIO, SCLK, CS

### Nets
1V8D: C306.1 C307.1 C309.1 C310.1 IC300.2(DACVDD18) IC300.8(DIGVDD18) IC300.29(DIGVDD18) IC300.36(DACVDD18) IC300.41(VFUSE) L300.1
3V3A: C302.1 C303.1 C304.1 C305.1 IC300.37(AVDD33) IC300.40(AVDD33) IC300.42(AVDD33) IC300.45(AVDD33) IC300.48(AVDD33)
DAC_BIAS: C315.1 C316.1 C317.1 C318.1 R310.1 R313.1 R316.1 R319.1
GND: C300.2 C301.2 C302.2 C303.2 C304.2 C305.2 C306.2 C307.2 C308.1 C309.2 C310.2 C315.2 C316.2 C317.2 C318.2 IC300.0(GND) IC300.5(GND) R302.2 R304.2 R305.2 R307.2 R308.2 R309.2 R312.2 R315.2 R318.2 R321.2
CLK_DAC_N: C312.1 R305.1 ; port CLK_DAC_N
CLK_DAC_P: C311.1 R304.1 ; port CLK_DAC_P
DAC_OSTR_N: C314.1 R308.1 ; port DAC_OSTR_N
DAC_OSTR_P: C313.1 R307.1 ; port DAC_OSTR_P
DACA_BIAS_N: R314.2 R315.1 ; port DACA_OUTN
DACA_BIAS_P: R311.2 R312.1 ; port DACA_OUTP
DACA_OUT_N: IC300.39(IOUTA2) R313.2 R314.1
DACA_OUT_P: IC300.38(IOUTA1) R310.2 R311.1
DACB_BIAS_N: R320.2 R321.1 ; port DACB_OUTN
DACB_BIAS_P: R317.2 R318.1 ; port DACB_OUTP
DACB_OUT_N: IC300.46(IOUTB2) R319.2 R320.1
DACB_OUT_P: IC300.47(IOUTB1) R316.2 R317.1
DACCLK_N: C312.2 IC300.4(DACCLKN) R303.2
DACCLK_P: C311.2 IC300.3(DACCLKP) R303.1
IO11_N: IC300.10(D0N) ; port DAC_D0N
IO11_P: IC300.9(D0P) ; port DAC_D0P
IO12_N: IC300.12(D1N) ; port DAC_D1N
IO12_P: IC300.11(D1P) ; port DAC_D1P
IO13_N: IC300.14(D2N) ; port DAC_D2N
IO13_P: IC300.13(D2P) ; port DAC_D2P
IO14_N: IC300.16(D3N) ; port DAC_D3N
IO14_P: IC300.15(D3P) ; port DAC_D3P
IO15_N: IC300.18(DATACLKN) ; port DAC_DATACLKN
IO15_P: IC300.17(DATACLKP) ; port DAC_DATACLKP
IO16_N: IC300.20(FRAMEN) ; port DAC_FRAMEN
IO16_P: IC300.19(FRAMEP) ; port DAC_FRAMEP
IO17_N: IC300.22(D4N) ; port DAC_D4N
IO17_P: IC300.21(D4P) ; port DAC_D4P
IO18_N: IC300.24(D5N) ; port DAC_D5N
IO18_P: IC300.23(D5P) ; port DAC_D5P
IO19_N: IC300.26(D6N) ; port DAC_D6N
IO19_P: IC300.25(D6P) ; port DAC_D6P
IO20_N: IC300.28(D7N) ; port DAC_D7N
IO20_P: IC300.27(D7P) ; port DAC_D7P
OSTR_N: C314.2 IC300.7(OSTRN) R306.2
OSTR_P: C313.2 IC300.6(OSTRP) R306.1
NetC300_1: C300.1 C301.1 IC300.1(CLKVDD18) IC300.35(CLKVDD18) L300.2
NetC308_2: C308.2 IC300.44(EXTIO)
NetIC300_30: IC300.30(TXENABLE) R309.1 ; port DAC_TXEN
NetIC300_31: IC300.31(SDIO) R301.2
NetIC300_32: IC300.32(SCLK) ; port DAC_CONFIG.SCLK
NetIC300_33: IC300.33(SDENB) ; port DAC_CONFIG.CS
NetIC300_34: IC300.34(ALARM_SDO) R300.1
NetIC300_43: IC300.43(BIASJ) R302.1
NetIC400_13: R300.2 ; port DAC_ALARM
NetIC400_17: R301.1 ; port DAC_CONFIG.SDIO

### Layout directives
differential pair: CLK_DAC_N, CLK_DAC_P, DAC_OSTR_N, DAC_OSTR_P, DACA_BIAS_N, DACA_BIAS_P, DACA_OUT_N, DACA_OUT_P, DACB_BIAS_N, DACB_BIAS_P, DACB_OUT_N, DACB_OUT_P, DACCLK_N, DACCLK_P, OSTR_N, OSTR_P

### Notes on the sheet
- Title
- Size:
- Date:
- A3
- Number:
- Time:
- Revision:
- Sheet
- of
- File:

### Library data of the parts
C300-C318 = C
IC300 = DAC3283: Dual-Channel,  16-Bit,  800  MSPS,  Digital-to-Analog  Converter  (DAC)
L300 = L
R300-R321 = R

## Sheet FPGA.SchDoc
size A3
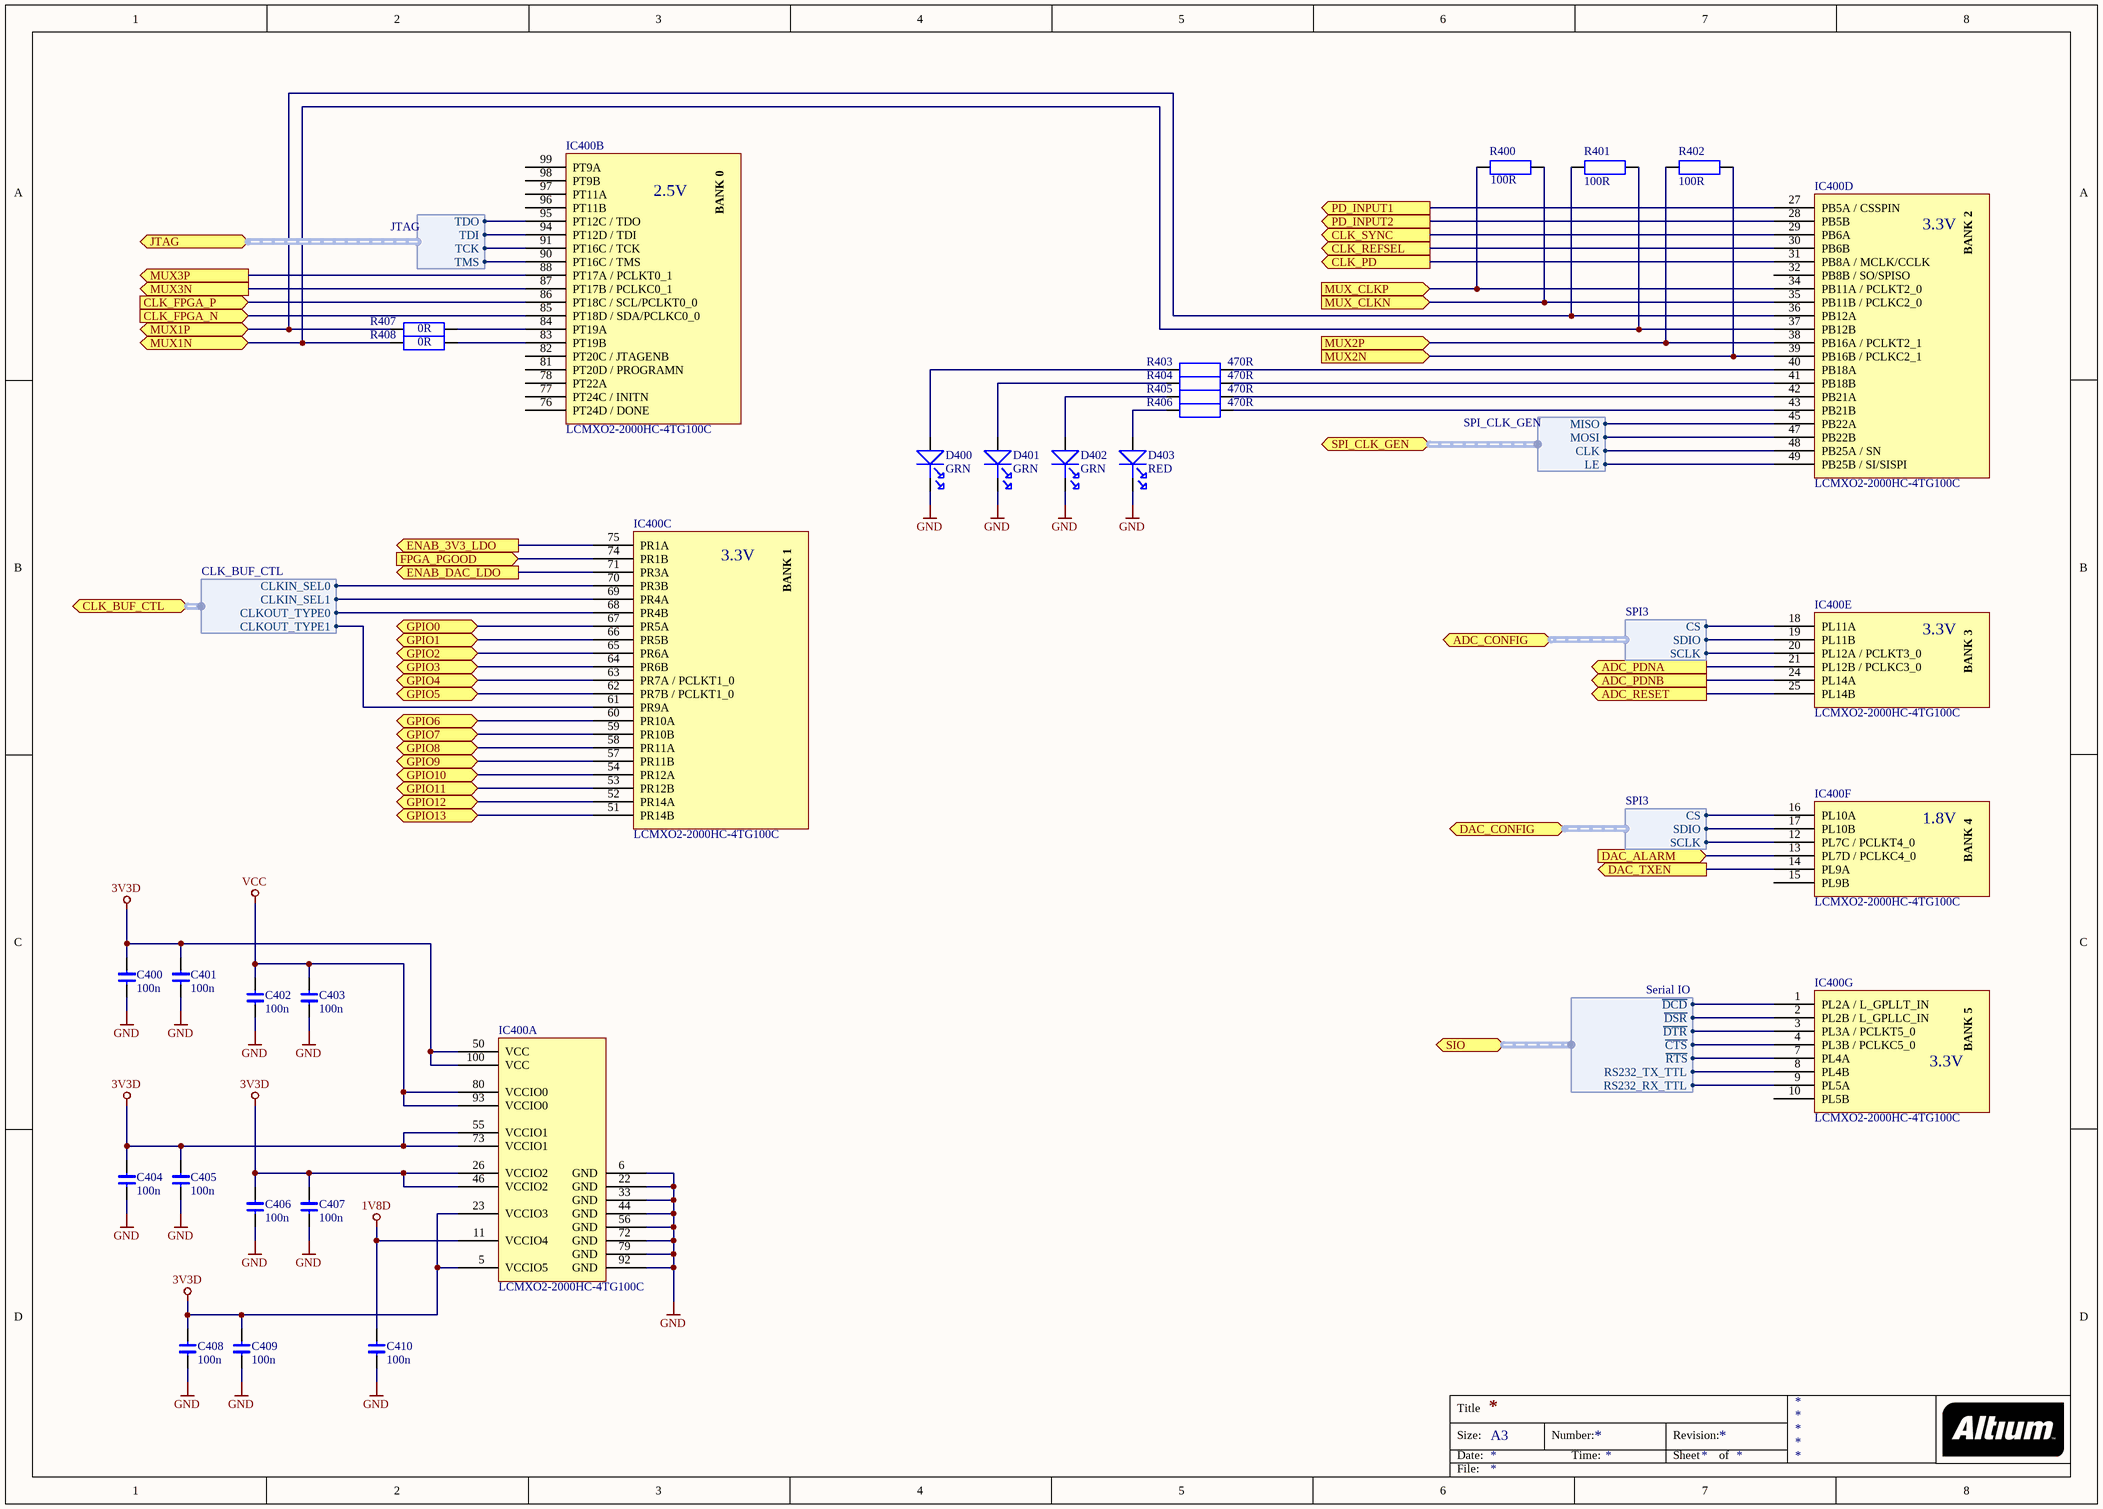
[diagram p4: FPGA.SchDoc]

### Parts
C400  100n  [0603 SMALL OUTLINE]
C401  100n  [0603 SMALL OUTLINE]
C402  100n  [0603 SMALL OUTLINE]
C403  100n  [0603 SMALL OUTLINE]
C404  100n  [0603 SMALL OUTLINE]
C405  100n  [0603 SMALL OUTLINE]
C406  100n  [0603 SMALL OUTLINE]
C407  100n  [0603 SMALL OUTLINE]
C408  100n  [0603 SMALL OUTLINE]
C409  100n  [0603 SMALL OUTLINE]
C410  100n  [0603 SMALL OUTLINE]
D400  GRN  [LED SMD 0603]
D401  GRN  [LED SMD 0603]
D402  GRN  [LED SMD 0603]
D403  RED  [LED SMD 0603]
IC400  LCMXO2-2000HC-4TG100C  [TQFP100]  (parts A,B,C,D,E,F,G of 7)
R400  100R  [0402]
R401  100R  [0402]
R402  100R  [0402]
R403  470R  [0603 SMALL OUTLINE]
R404  470R  [0603 SMALL OUTLINE]
R405  470R  [0603 SMALL OUTLINE]
R406  470R  [0603 SMALL OUTLINE]
R407  0R  [0402]
R408  0R  [0402]

### Ports
ADC_CONFIG (harness SPI3), ADC_PDNA (out), ADC_PDNB (out), ADC_RESET (out), CLK_BUF_CTL (harness CLK_BUF_CTL), CLK_FPGA_N (in), CLK_FPGA_P (in), CLK_PD (out), CLK_REFSEL (out), CLK_SYNC (out), DAC_ALARM (in), DAC_CONFIG (harness SPI3), DAC_TXEN (out), ENAB_3V3_LDO (out), ENAB_DAC_LDO (out), FPGA_PGOOD (in), GPIO0, GPIO1, GPIO2, GPIO3, GPIO4, GPIO5, GPIO6, GPIO7, GPIO8, GPIO9, GPIO10, GPIO11, GPIO12, GPIO13, JTAG (harness JTAG), MUX1N, MUX1P, MUX2N (in), MUX2P (in), MUX3N (out), MUX3P (out), MUX_CLKN (in), MUX_CLKP (in), PD_INPUT1 (out), PD_INPUT2 (out), SIO (harness Serial IO), SPI_CLK_GEN (harness SPI_CLK_GEN)

### Harnesses
JTAG: TCK, TDI, TDO, TMS
Serial IO: RS232_RX_TTL, RS232_TX_TTL, ~{RTS}, ~{CTS}, ~{DTR}, ~{DSR}, ~{DCD}
SPI3: SDIO, SCLK, CS
SPI_CLK_GEN: MISO, MOSI, CLK, LE
CLK_BUF_CTL: CLKIN_SEL0, CLKIN_SEL1, CLKOUT_TYPE0, CLKOUT_TYPE1

### Nets
1V8D: C410.1 IC400.11(VCCIO4)
3V3D: C400.1 C401.1 C404.1 C405.1 C406.1 C407.1 C408.1 C409.1 IC400.5(VCCIO5) IC400.23(VCCIO3) IC400.26(VCCIO2) IC400.46(VCCIO2) IC400.50(VCC) IC400.55(VCCIO1) IC400.73(VCCIO1) IC400.100(VCC)
GND: C400.2 C401.2 C402.2 C403.2 C404.2 C405.2 C406.2 C407.2 C408.2 C409.2 C410.2 D400.K D401.K D402.K D403.K IC400.6(GND) IC400.22(GND) IC400.33(GND) IC400.44(GND) IC400.56(GND) IC400.72(GND) IC400.79(GND) IC400.92(GND)
VCC: C402.1 C403.1 IC400.80(VCCIO0) IC400.93(VCCIO0)
CLK_FPGA_N: IC400.85(PT18D_/_SDA/PCLKC0_0) ; port CLK_FPGA_N
CLK_FPGA_P: IC400.86(PT18C_/_SCL/PCLKT0_0) ; port CLK_FPGA_P
FPGA_PGOOD: IC400.74(PR1B) ; port FPGA_PGOOD
IO4_N: IC400.87(PT17B_/_PCLKC0_1) ; port MUX3N
IO4_P: IC400.88(PT17A_/_PCLKT0_1) ; port MUX3P
IO7_N: IC400.35(PB11B_/_PCLKC2_0) R400.1 ; port MUX_CLKN
IO7_P: IC400.34(PB11A_/_PCLKT2_0) R400.2 ; port MUX_CLKP
IO8_N: IC400.37(PB12B) R401.1 R408.2 ; port MUX1N
IO8_P: IC400.36(PB12A) R401.2 R407.2 ; port MUX1P
IO9_N: IC400.39(PB16B_/_PCLKC2_1) R402.1 ; port MUX2N
IO9_P: IC400.38(PB16A_/_PCLKT2_1) R402.2 ; port MUX2P
JTAG_TCK: IC400.91(PT16C_/_TCK) ; port JTAG.TCK
JTAG_TDI: IC400.94(PT12D_/_TDI) ; port JTAG.TDI
JTAG_TDO: IC400.95(PT12C_/_TDO) ; port JTAG.TDO
JTAG_TMS: IC400.90(PT16C_/_TMS) ; port JTAG.TMS
NetD400_A: D400.A R403.2
NetD401_A: D401.A R404.2
NetD402_A: D402.A R405.2
NetD403_A: D403.A R406.2
NetIC100_4: IC400.25(PL14B) ; port ADC_RESET
NetIC100_30: IC400.24(PL14A) ; port ADC_PDNB
NetIC100_31: IC400.21(PL12B_/_PCLKC3_0) ; port ADC_PDNA
NetIC100_32: IC400.18(PL11A) ; port ADC_CONFIG.CS
NetIC100_34: IC400.20(PL12A_/_PCLKT3_0) ; port ADC_CONFIG.SCLK
NetIC200_12: IC400.27(PB5A_/_CSSPIN) ; port PD_INPUT1
NetIC201_12: IC400.28(PB5B) ; port PD_INPUT2
NetIC300_30: IC400.14(PL9A) ; port DAC_TXEN
NetIC300_32: IC400.12(PL7C_/_PCLKT4_0) ; port DAC_CONFIG.SCLK
NetIC300_33: IC400.16(PL10A) ; port DAC_CONFIG.CS
NetIC400_1: IC400.1(PL2A_/_L_GPLLT_IN) ; port SIO.~{DCD}
NetIC400_2: IC400.2(PL2B_/_L_GPLLC_IN) ; port SIO.~{DSR}
NetIC400_3: IC400.3(PL3A_/_PCLKT5_0) ; port SIO.~{DTR}
NetIC400_4: IC400.4(PL3B_/_PCLKC5_0) ; port SIO.~{CTS}
NetIC400_7: IC400.7(PL4A) ; port SIO.~{RTS}
NetIC400_8: IC400.8(PL4B) ; port SIO.RS232_TX_TTL
NetIC400_9: IC400.9(PL5A) ; port SIO.RS232_RX_TTL
NetIC400_13: IC400.13(PL7D_/_PCLKC4_0) ; port DAC_ALARM
NetIC400_17: IC400.17(PL10B) ; port DAC_CONFIG.SDIO
NetIC400_19: IC400.19(PL11B) ; port ADC_CONFIG.SDIO
NetIC400_29: IC400.29(PB6A) ; port CLK_SYNC
NetIC400_30: IC400.30(PB6B) ; port CLK_REFSEL
NetIC400_31: IC400.31(PB8A_/_MCLK/CCLK) ; port CLK_PD
NetIC400_40: IC400.40(PB18A) R403.1
NetIC400_41: IC400.41(PB18B) R404.1
NetIC400_42: IC400.42(PB21A) R405.1
NetIC400_43: IC400.43(PB21B) R406.1
NetIC400_45: IC400.45(PB22A) ; port SPI_CLK_GEN.MISO
NetIC400_47: IC400.47(PB22B) ; port SPI_CLK_GEN.MOSI
NetIC400_48: IC400.48(PB25A_/_SN) ; port SPI_CLK_GEN.CLK
NetIC400_49: IC400.49(PB25B_/_SI/SISPI) ; port SPI_CLK_GEN.LE
NetIC400_51: IC400.51(PR14B) ; port GPIO13
NetIC400_52: IC400.52(PR14A) ; port GPIO12
NetIC400_53: IC400.53(PR12B) ; port GPIO11
NetIC400_54: IC400.54(PR12A) ; port GPIO10
NetIC400_57: IC400.57(PR11B) ; port GPIO9
NetIC400_58: IC400.58(PR11A) ; port GPIO8
NetIC400_59: IC400.59(PR10B) ; port GPIO7
NetIC400_60: IC400.60(PR10A) ; port GPIO6
NetIC400_61: IC400.61(PR9A) ; port CLK_BUF_CTL.CLKOUT_TYPE1
NetIC400_62: IC400.62(PR7B_/_PCLKT1_0) ; port GPIO5
NetIC400_63: IC400.63(PR7A_/_PCLKT1_0) ; port GPIO4
NetIC400_64: IC400.64(PR6B) ; port GPIO3
NetIC400_65: IC400.65(PR6A) ; port GPIO2
NetIC400_66: IC400.66(PR5B) ; port GPIO1
NetIC400_67: IC400.67(PR5A) ; port GPIO0
NetIC400_68: IC400.68(PR4B) ; port CLK_BUF_CTL.CLKOUT_TYPE0
NetIC400_69: IC400.69(PR4A) ; port CLK_BUF_CTL.CLKIN_SEL1
NetIC400_70: IC400.70(PR3B) ; port CLK_BUF_CTL.CLKIN_SEL0
NetIC400_71: IC400.71(PR3A) ; port ENAB_DAC_LDO
NetIC400_75: IC400.75(PR1A) ; port ENAB_3V3_LDO
NetIC400_83: IC400.83(PT19B) R408.1
NetIC400_84: IC400.84(PT19A) R407.1

Not connected (* = marked no-connect by the designer): IC400 10(PL5B) 15(PL9B) 32(PB8B_/_SO/SPISO) 76(PT24D_/_DONE) 77(PT24C_/_INITN) 78(PT22A) 81(PT20D_/_PROGRAMN) 82(PT20C_/_JTAGENB) 96(PT11B) 97(PT11A) 98(PT9B) 99(PT9A)

### Notes on the sheet
- 2.5V
- 3.3V
- 1.8V
- Title
- Size:
- Date:
- A3
- Number:
- Time:
- Revision:
- Sheet
- of
- File:
- (in symbol LCMXO2-2000HC-4TG100C, part B) BANK 0
- (in symbol LCMXO2-2000HC-4TG100C, part C) BANK 1
- (in symbol LCMXO2-2000HC-4TG100C, part D) BANK 2
- (in symbol LCMXO2-2000HC-4TG100C, part E) BANK 3
- (in symbol LCMXO2-2000HC-4TG100C, part F) BANK 4
- (in symbol LCMXO2-2000HC-4TG100C, part G) BANK 5

### Library data of the parts
C400-C410 = C
D400-D402 = LED SMD: WURTH 150060VS75000
D403 = LED SMD: WURTH 150060SS75000
IC400 = LCMXO2-2000HC-4TG100C: Lattice MachXO2
R400-R408 = R

## Sheet Power.SchDoc
size A3
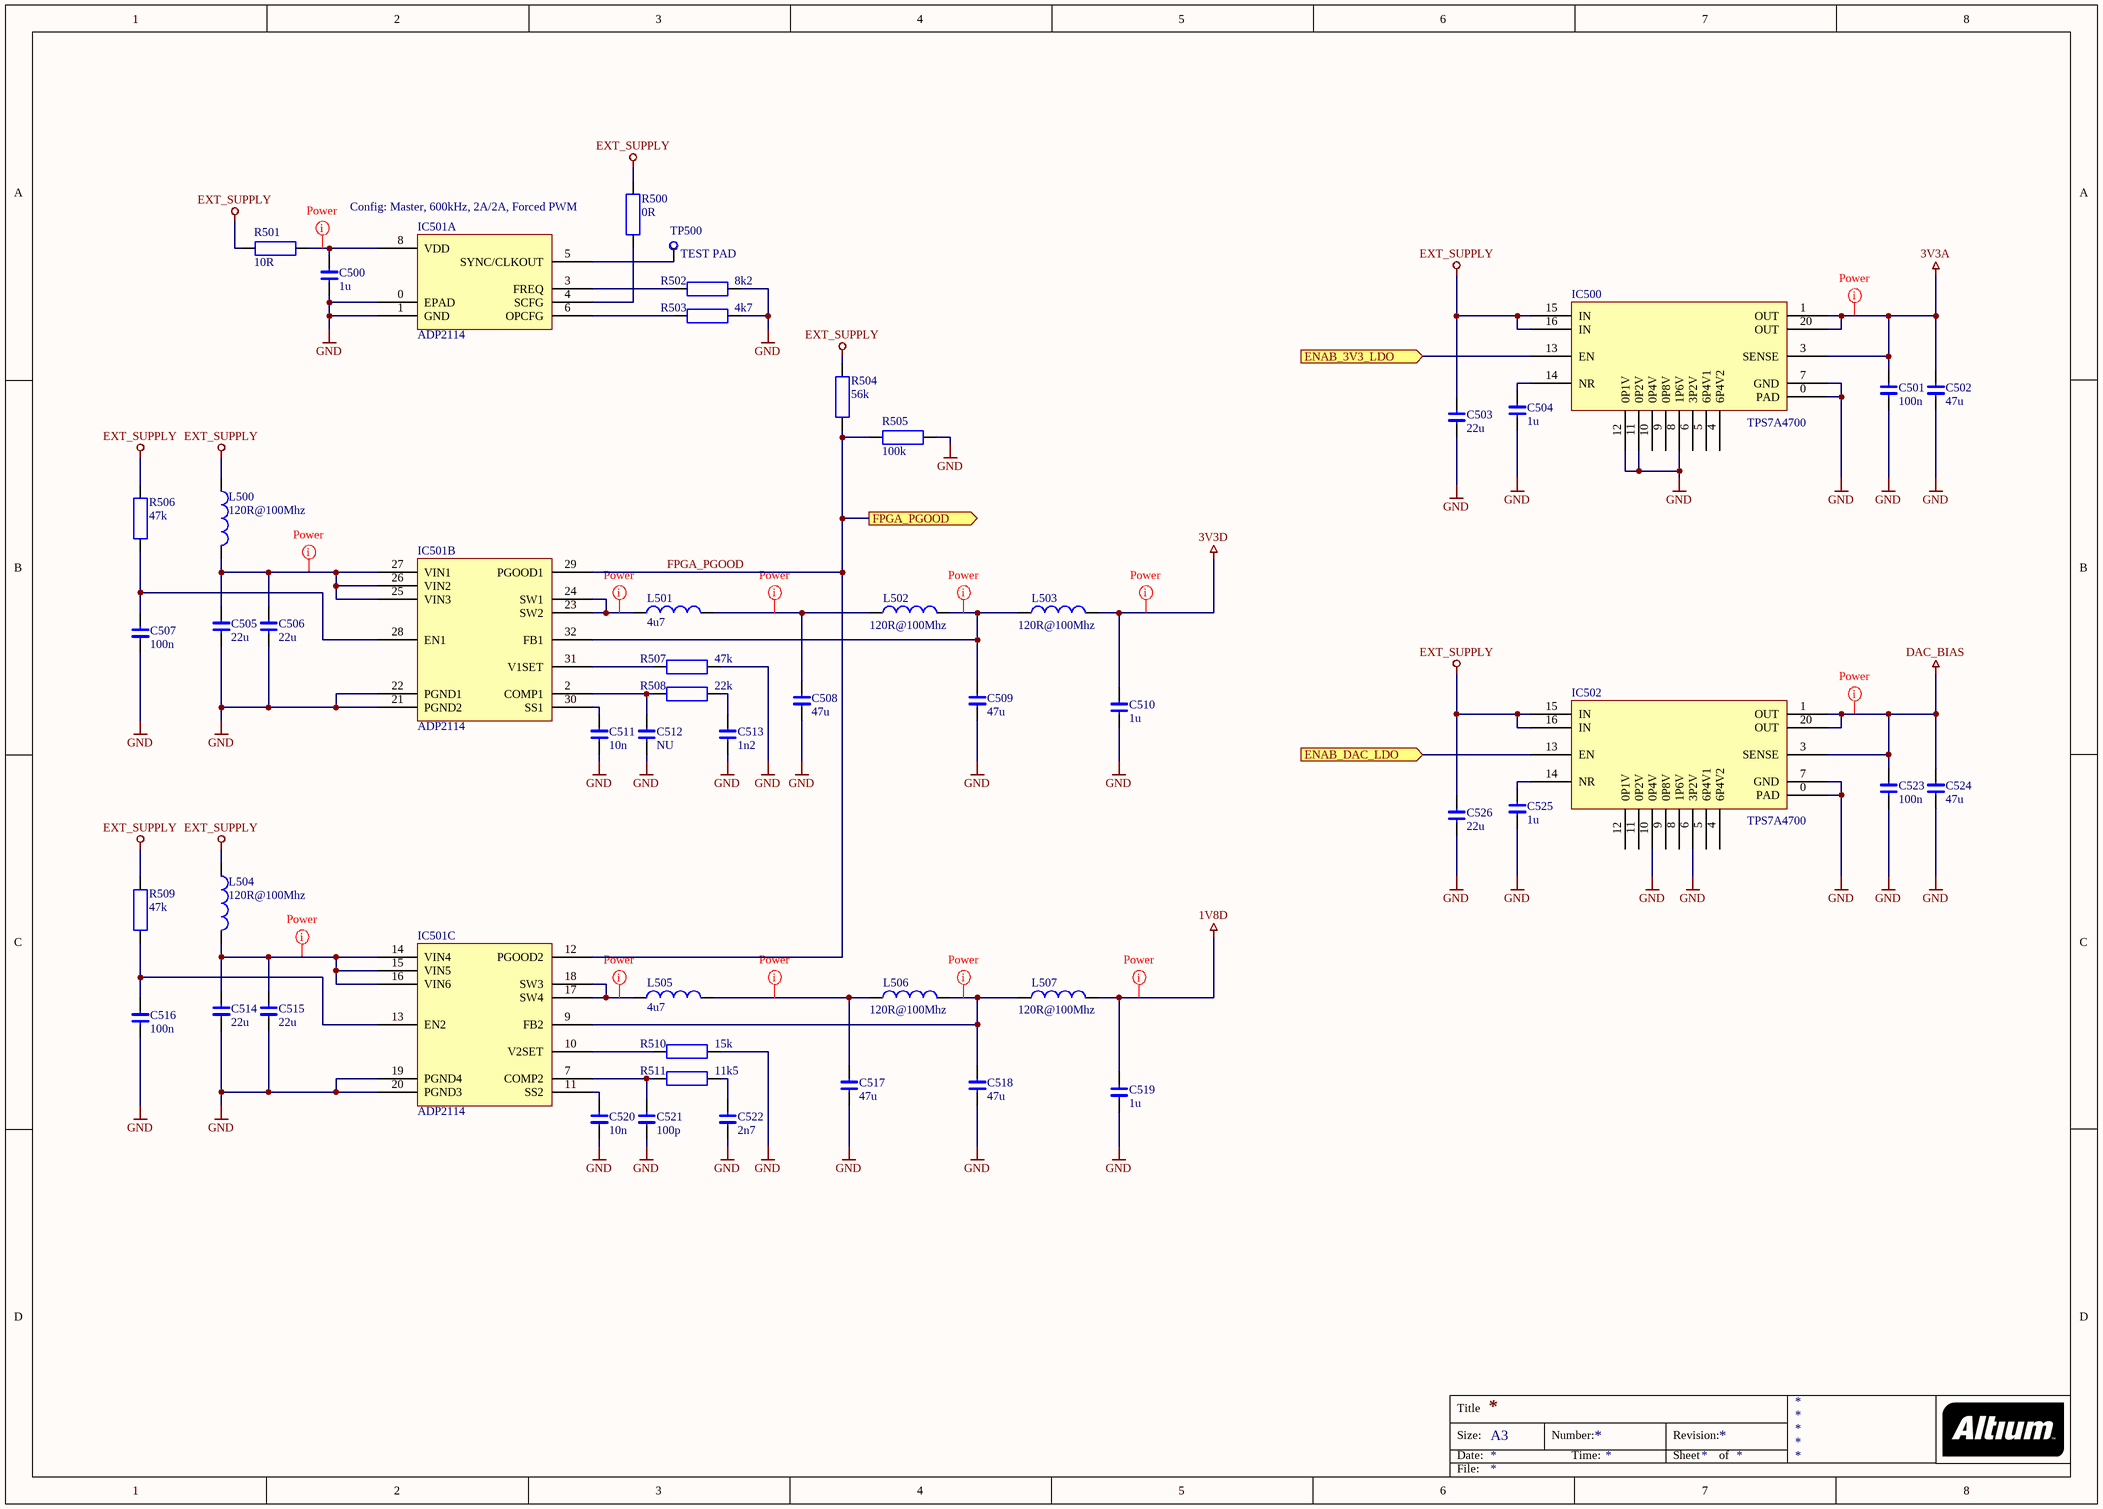
[diagram p5: Power.SchDoc]

### Parts
C500  1u  [0603 SMALL OUTLINE]
C501  100n  [0603 SMALL OUTLINE]
C502  47u  [1206]
C503  22u  [1206]
C504  1u  [0603 SMALL OUTLINE]
C505  22u  [1206]
C506  22u  [1206]
C507  100n  [0603 SMALL OUTLINE]
C508  47u  [1206]
C509  47u  [1206]
C510  1u  [0603 SMALL OUTLINE]
C511  10n  [0603 SMALL OUTLINE]
C512  NU  [0603 SMALL OUTLINE]
C513  1n2  [0603 SMALL OUTLINE]
C514  22u  [1206]
C515  22u  [1206]
C516  100n  [0603 SMALL OUTLINE]
C517  47u  [1206]
C518  47u  [1206]
C519  1u  [0603 SMALL OUTLINE]
C520  10n  [0603 SMALL OUTLINE]
C521  100p  [0603 SMALL OUTLINE]
C522  2n7  [0603 SMALL OUTLINE]
C523  100n  [0603 SMALL OUTLINE]
C524  47u  [1206]
C525  1u  [0603 SMALL OUTLINE]
C526  22u  [1206]
IC500  TPS7A4700  [VQFN20_LONG]
IC501  ADP2114  [LFCSP32_LONG]  (parts A,B,C of 3)
IC502  TPS7A4700  [VQFN20_LONG]
L500  120R@100Mhz  [0805]
L501  4u7  [DR74]
L502  120R@100Mhz  [0805]
L503  120R@100Mhz  [0805]
L504  120R@100Mhz  [0805]
L505  4u7  [DR74]
L506  120R@100Mhz  [0805]
L507  120R@100Mhz  [0805]
R500  0R  [0603 SMALL OUTLINE]
R501  10R  [0603 SMALL OUTLINE]
R502  8k2  [0603 SMALL OUTLINE]
R503  4k7  [0603 SMALL OUTLINE]
R504  56k  [0603 SMALL OUTLINE]
R505  100k  [0603 SMALL OUTLINE]
R506  47k  [0603 SMALL OUTLINE]
R507  47k  [0603 SMALL OUTLINE]
R508  22k  [0603 SMALL OUTLINE]
R509  47k  [0603 SMALL OUTLINE]
R510  15k  [0603 SMALL OUTLINE]
R511  11k5  [0603 SMALL OUTLINE]
TP500  TEST PAD  [TEST_PAD_50]

### Ports
ENAB_3V3_LDO (in), ENAB_DAC_LDO (in), FPGA_PGOOD (out)

### Nets
1V8D: C519.1 L507.2
3V3A: C501.1 C502.1 IC500.1(OUT) IC500.3(SENSE) IC500.20(OUT)
3V3D: C510.1 L503.2
DAC_BIAS: C523.1 C524.1 IC502.1(OUT) IC502.3(SENSE) IC502.20(OUT)
EXT_SUPPLY: C503.1 C526.1 IC500.15(IN) IC500.16(IN) IC502.15(IN) IC502.16(IN) L500.1 L504.1 R500.1 R501.2 R504.1 R506.2 R509.2
GND: C500.1 C501.2 C502.2 C503.2 C504.1 C505.2 C506.2 C507.2 C508.2 C509.2 C510.2 C511.2 C512.2 C513.2 C514.2 C515.2 C516.2 C517.2 C518.2 C519.2 C520.2 C521.2 C522.2 C523.2 C524.2 C525.1 C526.2 IC500.0(PAD) IC500.7(GND) IC500.8(1P6V) IC500.11(0P2V) IC500.12(0P1V) IC501.0(EPAD) IC501.1(GND) IC501.19(PGND4) IC501.20(PGND3) IC501.21(PGND2) IC501.22(PGND1) IC502.0(PAD) IC502.6(3P2V) IC502.7(GND) IC502.10(0P4V) R502.2 R503.2 R505.2 R507.2 R510.2
FPGA_PGOOD: IC501.12(PGOOD2) IC501.29(PGOOD1) R504.2 R505.1 ; port FPGA_PGOOD
NetC500_2: C500.2 IC501.8(VDD) R501.1
NetC504_2: C504.2 IC500.14(NR)
NetC505_1: C505.1 C506.1 IC501.25(VIN3) IC501.26(VIN2) IC501.27(VIN1) L500.2
NetC507_1: C507.1 IC501.28(EN1) R506.1
NetC508_1: C508.1 L501.2 L502.1
NetC509_1: C509.1 IC501.32(FB1) L502.2 L503.1
NetC511_1: C511.1 IC501.30(SS1)
NetC512_1: C512.1 IC501.2(COMP1) R508.1
NetC513_1: C513.1 R508.2
NetC514_1: C514.1 C515.1 IC501.14(VIN4) IC501.15(VIN5) IC501.16(VIN6) L504.2
NetC516_1: C516.1 IC501.13(EN2) R509.1
NetC517_1: C517.1 L505.2 L506.1
NetC518_1: C518.1 IC501.9(FB2) L506.2 L507.1
NetC520_1: C520.1 IC501.11(SS2)
NetC521_1: C521.1 IC501.7(COMP2) R511.1
NetC522_1: C522.1 R511.2
NetC525_2: C525.2 IC502.14(NR)
NetIC400_71: IC502.13(EN) ; port ENAB_DAC_LDO
NetIC400_75: IC500.13(EN) ; port ENAB_3V3_LDO
NetIC501_3: IC501.3(FREQ) R502.1
NetIC501_4: IC501.4(SCFG) R500.2
NetIC501_5: IC501.5(SYNC/CLKOUT) TP500.0
NetIC501_6: IC501.6(OPCFG) R503.1
NetIC501_10: IC501.10(V2SET) R510.1
NetIC501_17: IC501.17(SW4) IC501.18(SW3) L505.1
NetIC501_23: IC501.23(SW2) IC501.24(SW1) L501.1
NetIC501_31: IC501.31(V1SET) R507.1

Not connected (* = marked no-connect by the designer): IC500 4(6P4V2) 5(6P4V1) 6(3P2V) 9(0P8V) 10(0P4V); IC502 4(6P4V2) 5(6P4V1) 8(1P6V) 9(0P8V) 11(0P2V) 12(0P1V)

### Layout directives
net class Power: 1V8D, 3V3A, 3V3D, DAC_BIAS, NetC500_2, NetC505_1, NetC508_1, NetC509_1, NetC514_1, NetC517_1, NetC518_1, NetIC501_17, NetIC501_23

### Notes on the sheet
- Config: Master, 600kHz, 2A/2A, Forced PWM
- Title
- Size:
- Date:
- A3
- Number:
- Time:
- Revision:
- Sheet
- of
- File:

### Library data of the parts
C500-C526 = C
IC500 IC502 = TPS7A4700: 36V, 1A, Low Noise, RF LDO Voltage Regulator
IC501 = ADP2114: Configurable DC/DC Sync. Buck, Dual 2A / Single 4A
L500 L502-L504 L506 L507 = L: 742792023
L501 L505 = L: DR74-XXX-R
R500-R511 = R

## Sheet USB.SchDoc
size A3
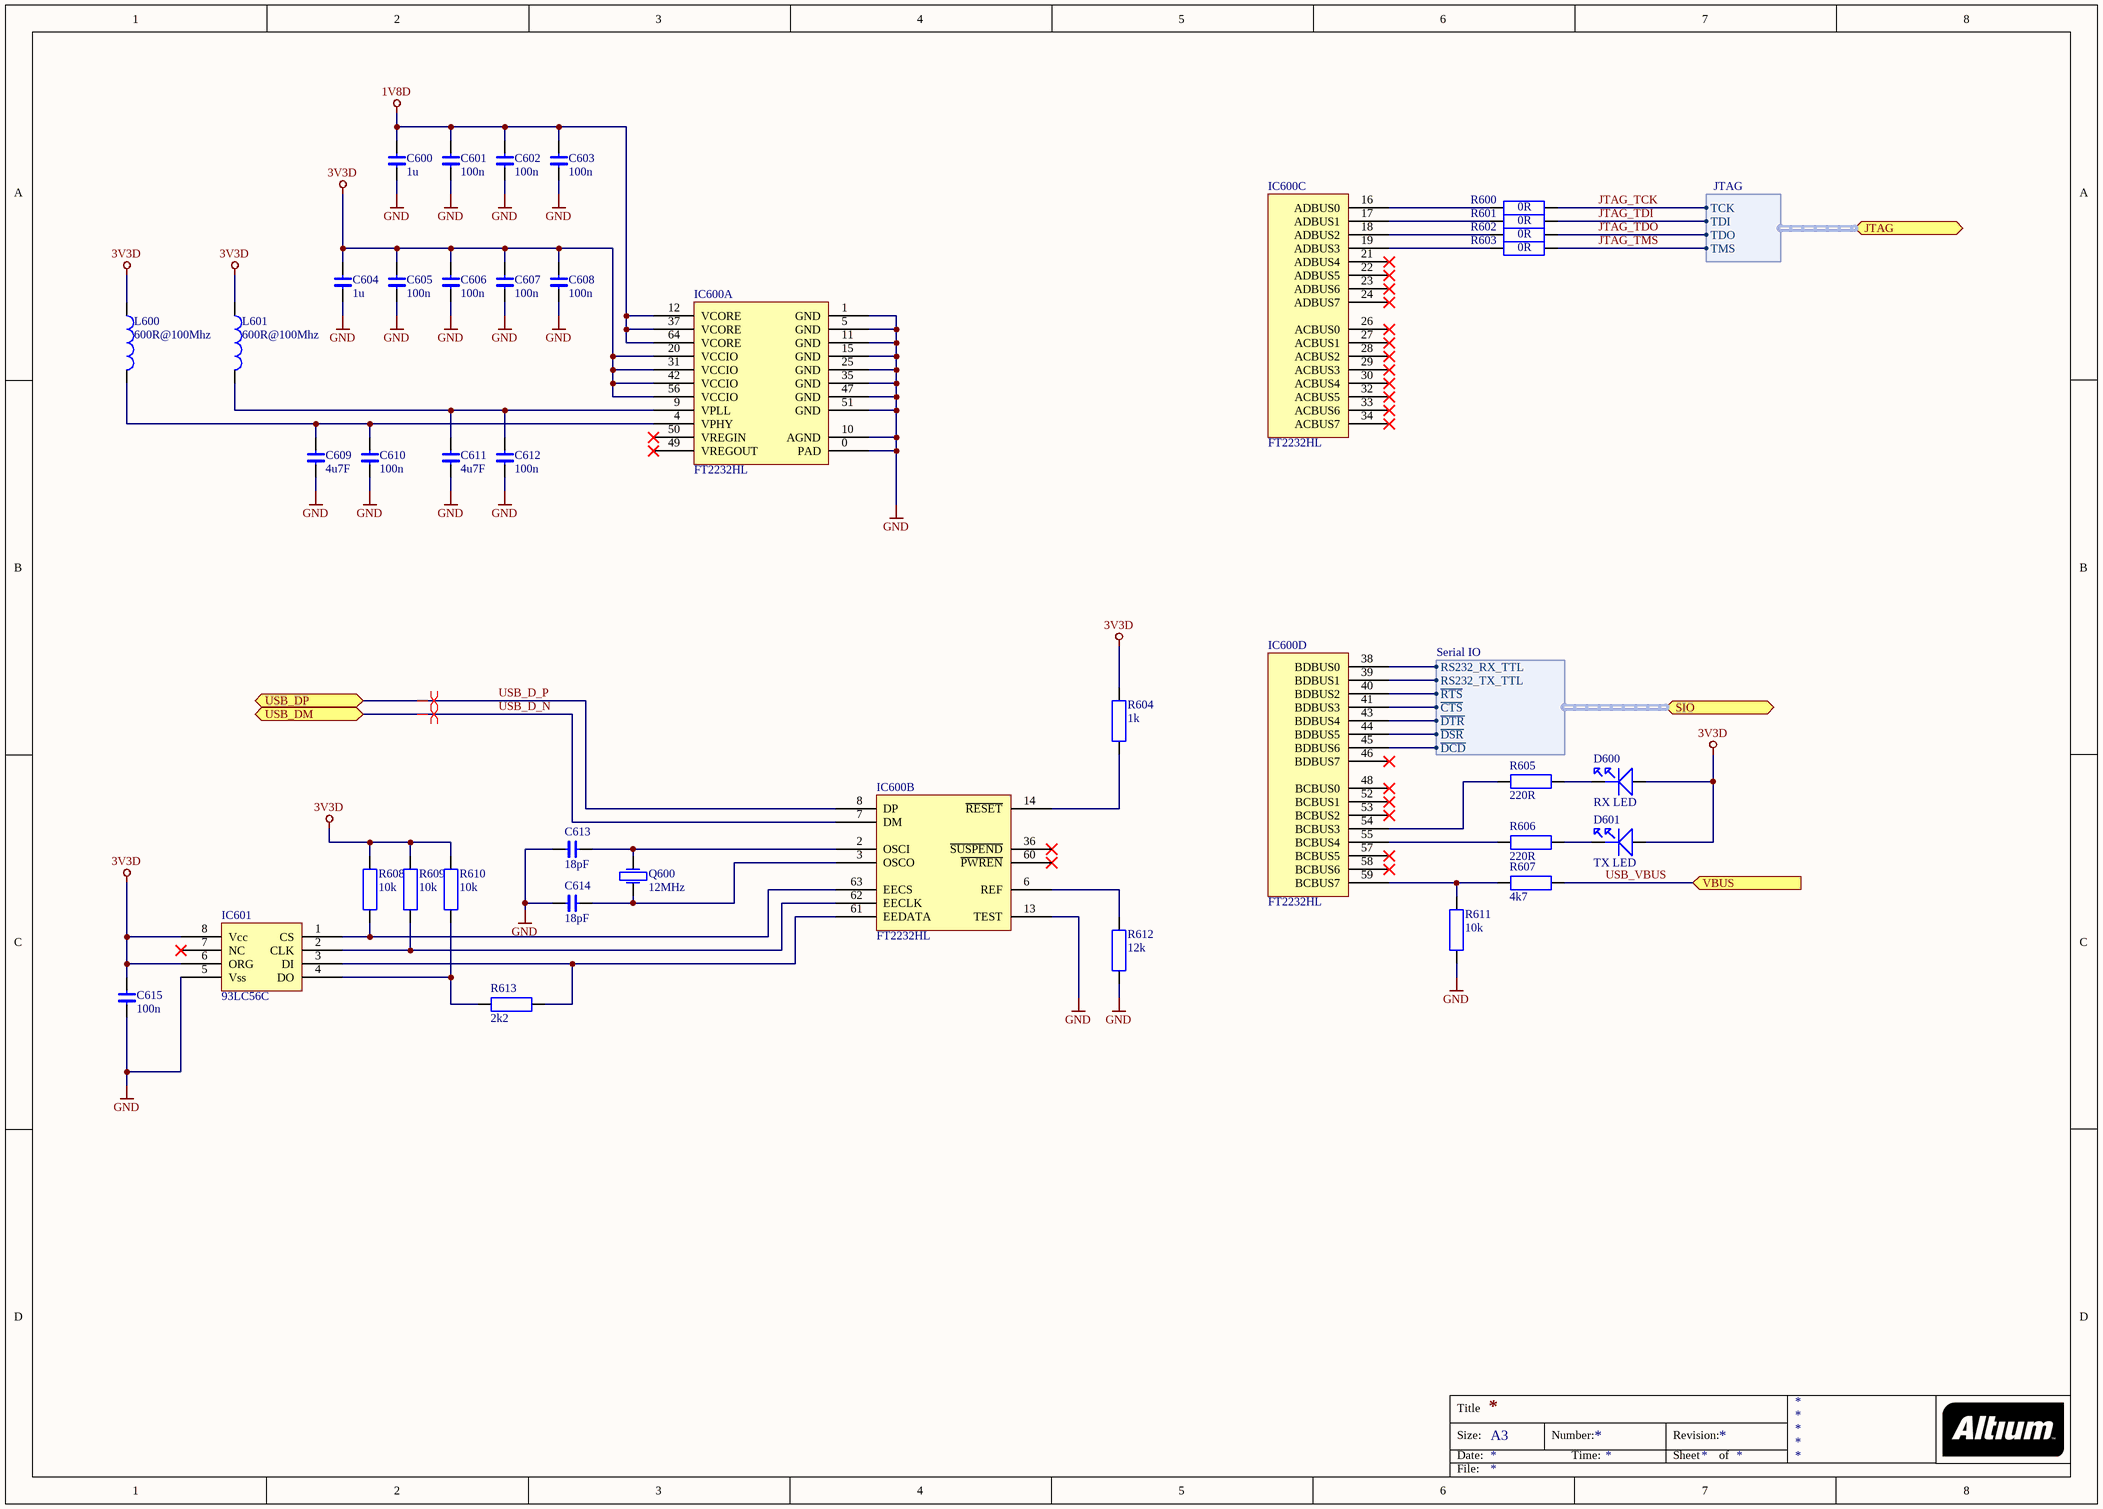
[diagram p6: USB.SchDoc]

### Parts
C600  1u  [0603 SMALL OUTLINE]
C601  100n  [0603 SMALL OUTLINE]
C602  100n  [0603 SMALL OUTLINE]
C603  100n  [0603 SMALL OUTLINE]
C604  1u  [0603 SMALL OUTLINE]
C605  100n  [0603 SMALL OUTLINE]
C606  100n  [0603 SMALL OUTLINE]
C607  100n  [0603 SMALL OUTLINE]
C608  100n  [0603 SMALL OUTLINE]
C609  4u7F  [0603 SMALL OUTLINE]
C610  100n  [0603 SMALL OUTLINE]
C611  4u7F  [0603 SMALL OUTLINE]
C612  100n  [0603 SMALL OUTLINE]
C613  18pF  [0603 SMALL OUTLINE]
C614  18pF  [0603 SMALL OUTLINE]
C615  100n  [0603 SMALL OUTLINE]
D600  RX LED  [LED SMD 0603]
D601  TX LED  [LED SMD 0603]
IC600  FT2232HL  [64QFN]  (parts A,B,C,D of 4)
IC601  93LC56C  [MSOP8]
L600  600R@100Mhz  [0805]
L601  600R@100Mhz  [0805]
Q600  12MHz  [SMD_XTAL_5x3.2]
R600  0R  [0603 SMALL OUTLINE]
R601  0R  [0603 SMALL OUTLINE]
R602  0R  [0603 SMALL OUTLINE]
R603  0R  [0603 SMALL OUTLINE]
R604  1k  [0603 SMALL OUTLINE]
R605  220R  [0603 SMALL OUTLINE]
R606  220R  [0603 SMALL OUTLINE]
R607  4k7  [0603 SMALL OUTLINE]
R608  10k  [0603 SMALL OUTLINE]
R609  10k  [0603 SMALL OUTLINE]
R610  10k  [0603 SMALL OUTLINE]
R611  10k  [0603 SMALL OUTLINE]
R612  12k  [0603 SMALL OUTLINE]
R613  2k2  [0603 SMALL OUTLINE]

### Ports
JTAG (harness JTAG), SIO (harness Serial IO), USB_DM (bidir), USB_DP (bidir), VBUS (in)

### Harnesses
JTAG: TCK, TDI, TDO, TMS
Serial IO: RS232_RX_TTL, RS232_TX_TTL, ~{RTS}, ~{CTS}, ~{DTR}, ~{DSR}, ~{DCD}

### Nets
1V8D: C600.1 C601.1 C602.1 C603.1 IC600.12(VCORE) IC600.37(VCORE) IC600.64(VCORE)
3V3D: C604.1 C605.1 C606.1 C607.1 C608.1 C615.1 D600.A D601.A IC600.20(VCCIO) IC600.31(VCCIO) IC600.42(VCCIO) IC600.56(VCCIO) IC601.6(ORG) IC601.8(Vcc) L600.1 L601.1 R604.2 R608.2 R609.2 R610.2
GND: C600.2 C601.2 C602.2 C603.2 C604.2 C605.2 C606.2 C607.2 C608.2 C609.2 C610.2 C611.2 C612.2 C613.2 C614.2 C615.2 IC600.0(PAD) IC600.1(GND) IC600.5(GND) IC600.10(AGND) IC600.11(GND) IC600.13(TEST) IC600.15(GND) IC600.25(GND) IC600.35(GND) IC600.47(GND) IC600.51(GND) IC601.5(Vss) R611.1 R612.1
JTAG_TCK: R600.2 ; port JTAG.TCK
JTAG_TDI: R601.2 ; port JTAG.TDI
JTAG_TDO: R602.2 ; port JTAG.TDO
JTAG_TMS: R603.2 ; port JTAG.TMS
USB_D_N: IC600.7(DM) ; port USB_DM
USB_D_P: IC600.8(DP) ; port USB_DP
USB_VBUS: R607.1 ; port VBUS
NetC609_1: C609.1 C610.1 IC600.4(VPHY) L600.2
NetC611_1: C611.1 C612.1 IC600.9(VPLL) L601.2
NetC613_1: C613.1 IC600.2(OSCI) Q600.2
NetC614_1: C614.1 IC600.3(OSCO) Q600.1
NetD600_K: D600.K R605.1
NetD601_K: D601.K R606.1
NetIC400_1: IC600.45(BDBUS6) ; port SIO.~{DCD}
NetIC400_2: IC600.44(BDBUS5) ; port SIO.~{DSR}
NetIC400_3: IC600.43(BDBUS4) ; port SIO.~{DTR}
NetIC400_4: IC600.41(BDBUS3) ; port SIO.~{CTS}
NetIC400_7: IC600.40(BDBUS2) ; port SIO.~{RTS}
NetIC400_8: IC600.39(BDBUS1) ; port SIO.RS232_TX_TTL
NetIC400_9: IC600.38(BDBUS0) ; port SIO.RS232_RX_TTL
NetIC600_6: IC600.6(REF) R612.2
NetIC600_14: IC600.14(~{RESET}) R604.1
NetIC600_16: IC600.16(ADBUS0) R600.1
NetIC600_17: IC600.17(ADBUS1) R601.1
NetIC600_18: IC600.18(ADBUS2) R602.1
NetIC600_19: IC600.19(ADBUS3) R603.1
NetIC600_54: IC600.54(BCBUS3) R605.2
NetIC600_55: IC600.55(BCBUS4) R606.2
NetIC600_59: IC600.59(BCBUS7) R607.2 R611.2
NetIC600_61: IC600.61(EEDATA) IC601.3(DI) R613.2
NetIC600_62: IC600.62(EECLK) IC601.2(CLK) R609.1
NetIC600_63: IC600.63(EECS) IC601.1(CS) R608.1
NetIC601_4: IC601.4(DO) R610.1 R613.1

Not connected (* = marked no-connect by the designer): IC600 21(ADBUS4)* 22(ADBUS5)* 23(ADBUS6)* 24(ADBUS7)* 26(ACBUS0)* 27(ACBUS1)* 28(ACBUS2)* 29(ACBUS3)* 30(ACBUS4)* 32(ACBUS5)* 33(ACBUS6)* 34(ACBUS7)* 36(~{SUSPEND})* 46(BDBUS7)* 48(BCBUS0)* 49(VREGOUT)* 50(VREGIN)* 52(BCBUS1)* 53(BCBUS2)* 57(BCBUS5)* 58(BCBUS6)* 60(~{PWREN})*; IC601 7(NC)*

### Layout directives
differential pair: USB_D_N, USB_D_P

### Notes on the sheet
- Title
- Size:
- Date:
- A3
- Number:
- Time:
- Revision:
- Sheet
- of
- File:

### Library data of the parts
C600-C615 = C
D600 D601 = LED SMD: WURTH 150060VS75000
IC600 = FT2232HL: DUAL HIGH SPEED USB TO MULTIPURPOSE UART/FIFO IC
IC601 = 93LC56C: 2K Microwire Compatible Serial EEPROM
L600 L601 = L
Q600 = CRYSTAL: XX MHz
R600-R613 = R

## Sheet Clock.SchDoc
size A3
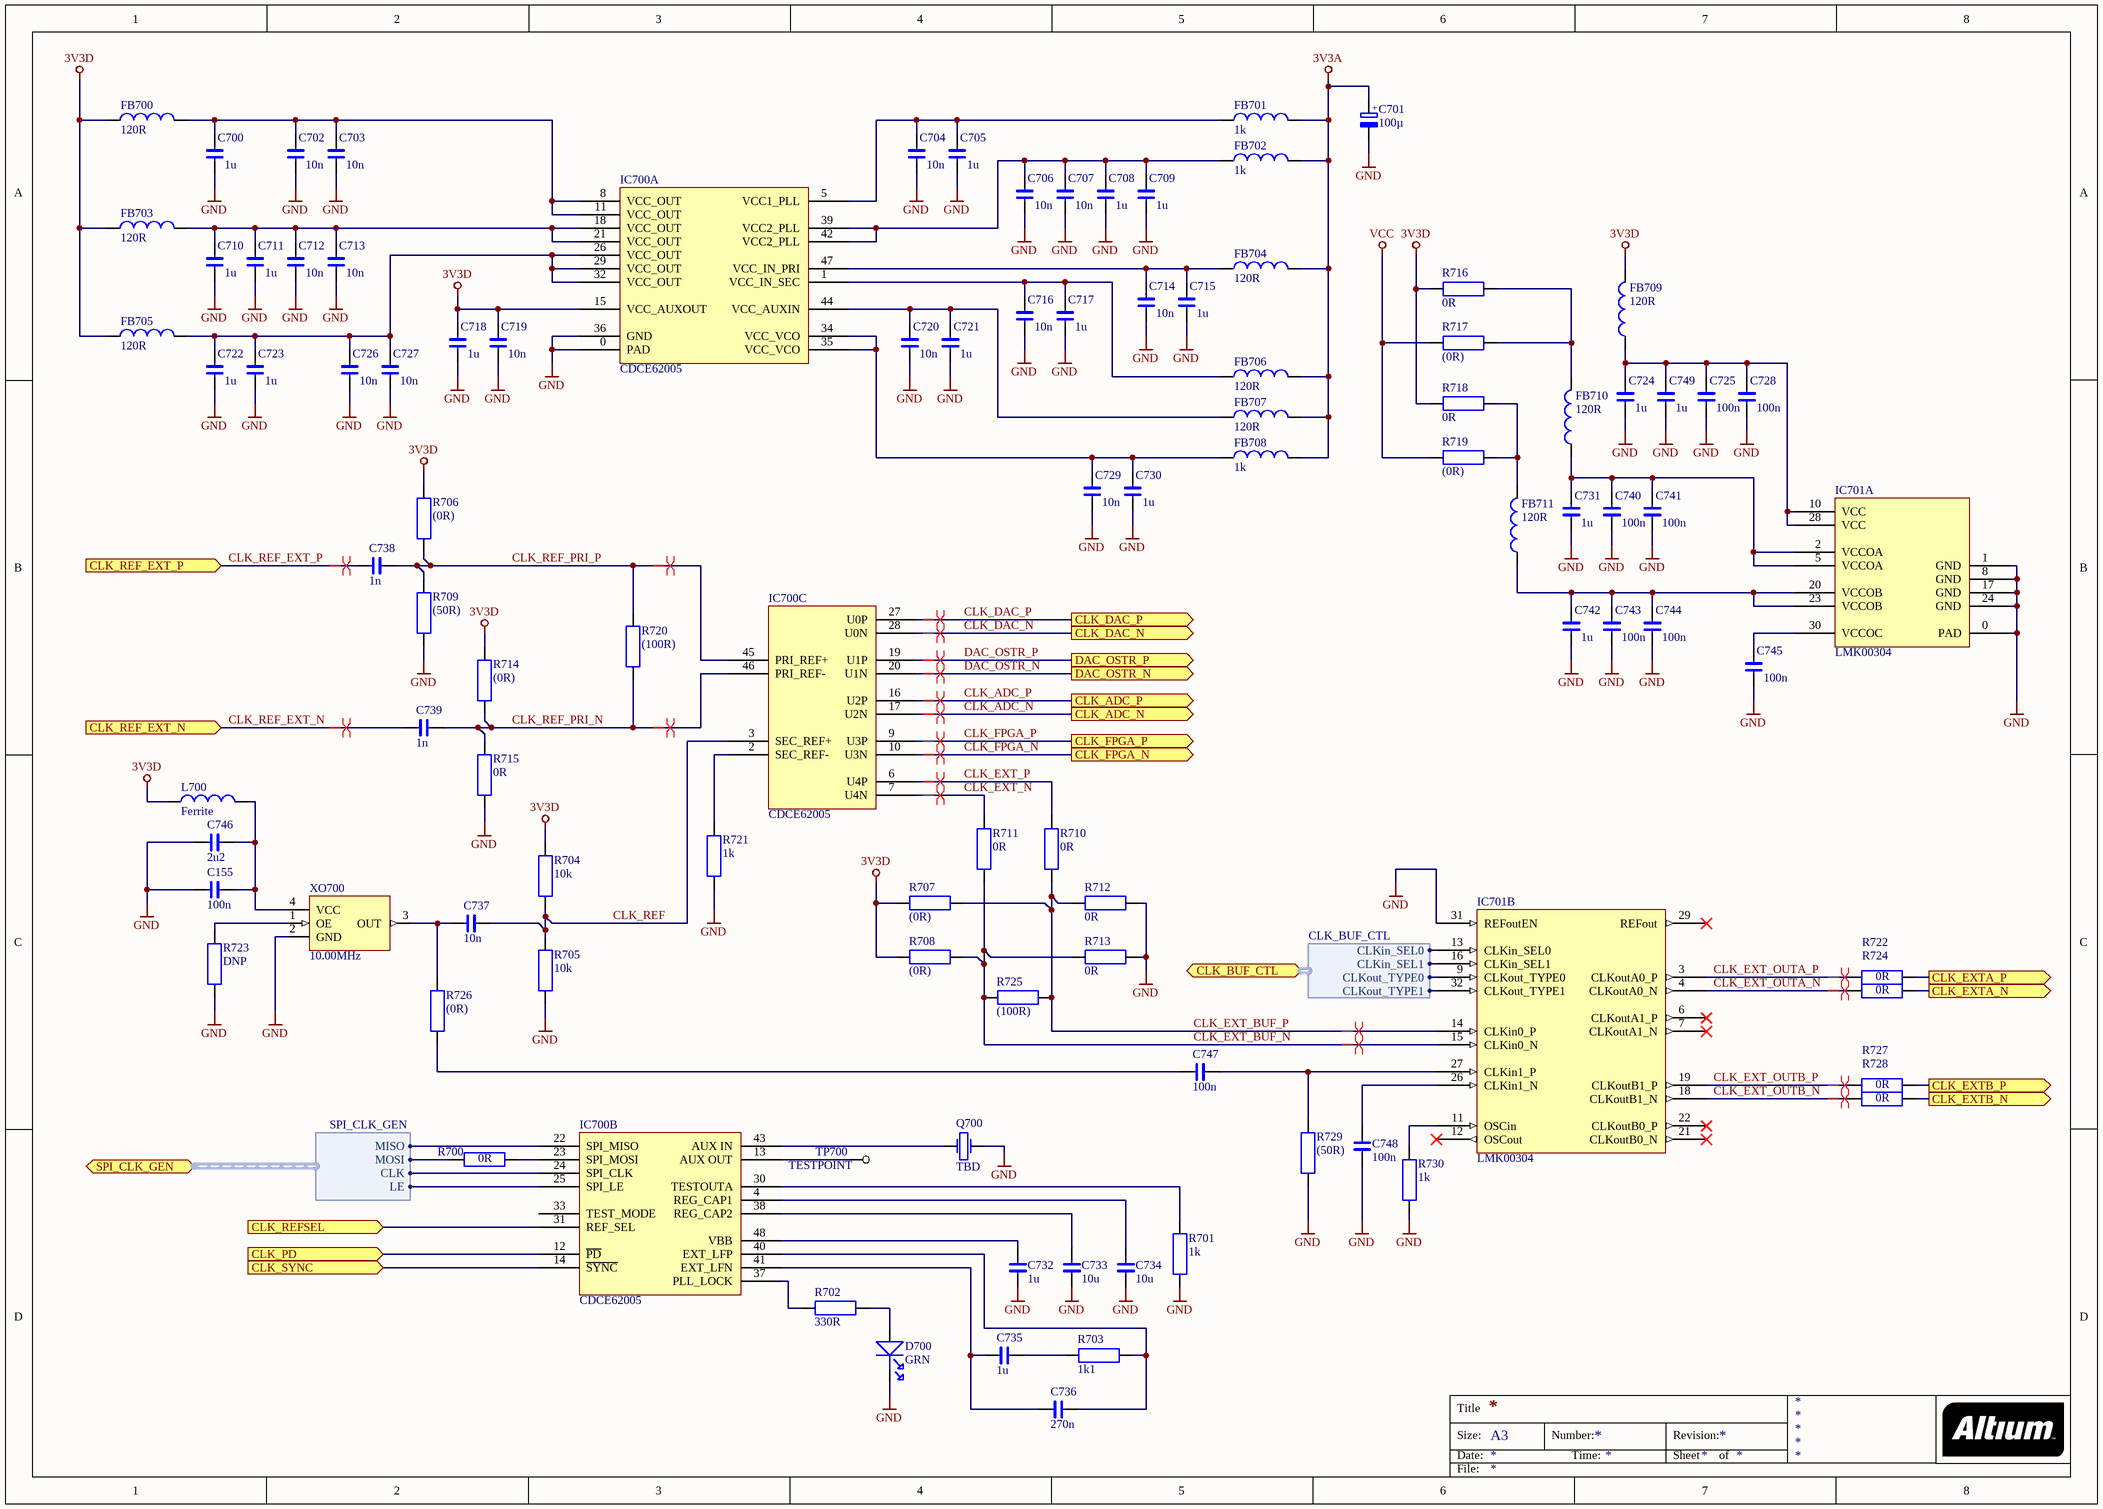
[diagram p7: Clock.SchDoc]

### Parts
C155  100n  [0603 SMALL OUTLINE]
C700  1u  [0603 SMALL OUTLINE]
C701  100µ  [SMD_ELKO_6.3]
C702  10n  [0402]
C703  10n  [0402]
C704  10n  [0402]
C705  1u  [0603 SMALL OUTLINE]
C706  10n  [0402]
C707  10n  [0402]
C708  1u  [0603 SMALL OUTLINE]
C709  1u  [0603 SMALL OUTLINE]
C710  1u  [0603 SMALL OUTLINE]
C711  1u  [0603 SMALL OUTLINE]
C712  10n  [0402]
C713  10n  [0402]
C714  10n  [0402]
C715  1u  [0603 SMALL OUTLINE]
C716  10n  [0402]
C717  1u  [0603 SMALL OUTLINE]
C718  1u  [0603 SMALL OUTLINE]
C719  10n  [0402]
C720  10n  [0402]
C721  1u  [0603 SMALL OUTLINE]
C722  1u  [0603 SMALL OUTLINE]
C723  1u  [0603 SMALL OUTLINE]
C724  1u  [0603 SMALL OUTLINE]
C725  100n  [0402]
C726  10n  [0402]
C727  10n  [0402]
C728  100n  [0402]
C729  10n  [0402]
C730  1u  [0603 SMALL OUTLINE]
C731  1u  [0603 SMALL OUTLINE]
C732  1u  [0603 SMALL OUTLINE]
C733  10u  [0805 SMALL OUTLINE]
C734  10u  [0805 SMALL OUTLINE]
C735  1u  [0603 SMALL OUTLINE]
C736  270n  [0603 SMALL OUTLINE]
C737  10n  [0603 SMALL OUTLINE]
C738  1n  [0603 SMALL OUTLINE]
C739  1n  [0603 SMALL OUTLINE]
C740  100n  [0402]
C741  100n  [0402]
C742  1u  [0603 SMALL OUTLINE]
C743  100n  [0402]
C744  100n  [0402]
C745  100n  [0402]
C746  2u2  [0603 SMALL OUTLINE]
C747  100n  [0603 SMALL OUTLINE]
C748  100n  [0402]
C749  1u  [0603 SMALL OUTLINE]
D700  GRN  [LED SMD 0603]
FB700  120R  [0805 SMALL OUTLINE]
FB701  1k  [0805 SMALL OUTLINE]
FB702  1k  [0805 SMALL OUTLINE]
FB703  120R  [0805 SMALL OUTLINE]
FB704  120R  [0805 SMALL OUTLINE]
FB705  120R  [0805 SMALL OUTLINE]
FB706  120R  [0805 SMALL OUTLINE]
FB707  120R  [0805 SMALL OUTLINE]
FB708  1k  [0805 SMALL OUTLINE]
FB709  120R  [0805 SMALL OUTLINE]
FB710  120R  [0805 SMALL OUTLINE]
FB711  120R  [0805 SMALL OUTLINE]
IC700  CDCE62005  [48VQFN]  (parts A,B,C of 3)
IC701  LMK00304  [WQFN32_LONG]  (parts A,B of 2)
L700  Ferrite  [0805]
Q700  TBD  [XTAL_SMD_60_35]
R700  0R  [0603 SMALL OUTLINE]
R701  1k  [0603 SMALL OUTLINE]
R702  330R  [0603 SMALL OUTLINE]
R703  1k1  [0603 SMALL OUTLINE]
R704  10k  [0603 SMALL OUTLINE]
R705  10k  [0603 SMALL OUTLINE]
R706  (0R)  [0402]
R707  (0R)  [0402]
R708  (0R)  [0402]
R709  (50R)  [0402]
R710  0R  [0402]
R711  0R  [0402]
R712  0R  [0402]
R713  0R  [0402]
R714  (0R)  [0402]
R715  0R  [0402]
R716  0R  [0603 SMALL OUTLINE]
R717  (0R)  [0603 SMALL OUTLINE]
R718  0R  [0603 SMALL OUTLINE]
R719  (0R)  [0603 SMALL OUTLINE]
R720  (100R)  [0402]
R721  1k  [0603 SMALL OUTLINE]
R722  0R  [0402]
R723  DNP  [0603 SMALL OUTLINE]
R724  0R  [0402]
R725  (100R)  [0402]
R726  (0R)  [0603 SMALL OUTLINE]
R727  0R  [0402]
R728  0R  [0402]
R729  (50R)  [0402]
R730  1k  [0603 SMALL OUTLINE]
TP700  TESTPOINT  [TEST_PAD_50]
XO700  10.00MHz  [AST3TQ]

### Ports
CLK_ADC_N (out), CLK_ADC_P (out), CLK_BUF_CTL (harness CLK_BUF_CTL), CLK_DAC_N (out), CLK_DAC_P (out), CLK_EXTA_N (out), CLK_EXTA_P (out), CLK_EXTB_N (out), CLK_EXTB_P (out), CLK_FPGA_N (out), CLK_FPGA_P (out), CLK_PD (in), CLK_REF_EXT_N (in), CLK_REF_EXT_P (in), CLK_REFSEL (in), CLK_SYNC (in), DAC_OSTR_N (out), DAC_OSTR_P (out), SPI_CLK_GEN (harness SPI_CLK_GEN)

### Harnesses
SPI_CLK_GEN: MOSI, MISO, CLK, LE
CLK_BUF_CTL: CLKin_SEL0, CLKin_SEL1, CLKout_TYPE0, CLKout_TYPE1

### Nets
3V3A: C701.1(+) FB701.2 FB702.2 FB704.2 FB706.2 FB707.2 FB708.2
3V3D: C718.1 C719.1 FB700.1 FB703.1 FB705.1 FB709.2 IC700.15(VCC_AUXOUT) L700.1 R704.2 R706.2 R707.2 R708.2 R714.2 R716.2 R718.2
GND: C155.2 C700.2 C701.2(-) C702.2 C703.2 C704.2 C705.2 C706.2 C707.2 C708.2 C709.2 C710.2 C711.2 C712.2 C713.2 C714.2 C715.2 C716.2 C717.2 C718.2 C719.2 C720.2 C721.2 C722.2 C723.2 C724.2 C725.2 C726.2 C727.2 C728.2 C729.2 C730.2 C731.2 C732.2 C733.2 C734.2 C740.2 C741.2 C742.2 C743.2 C744.2 C745.2 C746.2 C748.2 C749.2 D700.K IC700.0(PAD) IC700.36(GND) IC701.0(PAD) IC701.1(GND) IC701.8(GND) IC701.17(GND) IC701.24(GND) IC701.31(REFoutEN) Q700.2 R701.2 R705.1 R709.1 R712.1 R713.1 R715.1 R721.1 R723.1 R729.1 R730.1 XO700.2(GND)
VCC: R717.2 R719.2
CLK_ADC_N: IC700.17(U2N) ; port CLK_ADC_N
CLK_ADC_P: IC700.16(U2P) ; port CLK_ADC_P
CLK_DAC_N: IC700.28(U0N) ; port CLK_DAC_N
CLK_DAC_P: IC700.27(U0P) ; port CLK_DAC_P
CLK_EXT_BUF_N: IC701.15(CLKin0_N) R708.1 R711.1 R713.2 R725.1
CLK_EXT_BUF_P: IC701.14(CLKin0_P) R707.1 R710.1 R712.2 R725.2
CLK_EXT_N: IC700.7(U4N) R711.2
CLK_EXT_OUTA_N: IC701.4(CLKoutA0_N) R724.1
CLK_EXT_OUTA_P: IC701.3(CLKoutA0_P) R722.1
CLK_EXT_OUTB_N: IC701.18(CLKoutB1_N) R728.1
CLK_EXT_OUTB_P: IC701.19(CLKoutB1_P) R727.1
CLK_EXT_P: IC700.6(U4P) R710.2
CLK_EXTA_N: R724.2 ; port CLK_EXTA_N
CLK_EXTA_P: R722.2 ; port CLK_EXTA_P
CLK_EXTB_N: R728.2 ; port CLK_EXTB_N
CLK_EXTB_P: R727.2 ; port CLK_EXTB_P
CLK_FPGA_N: IC700.10(U3N) ; port CLK_FPGA_N
CLK_FPGA_P: IC700.9(U3P) ; port CLK_FPGA_P
CLK_REF: C737.2 IC700.3(SEC_REF+) R704.1 R705.2
CLK_REF_EXT_N: C739.1 ; port CLK_REF_EXT_N
CLK_REF_EXT_P: C738.1 ; port CLK_REF_EXT_P
CLK_REF_PRI_N: C739.2 IC700.46(PRI_REF-) R714.1 R715.2 R720.1
CLK_REF_PRI_P: C738.2 IC700.45(PRI_REF+) R706.1 R709.2 R720.2
DAC_OSTR_N: IC700.20(U1N) ; port DAC_OSTR_N
DAC_OSTR_P: IC700.19(U1P) ; port DAC_OSTR_P
NetC155_1: C155.1 C746.1 L700.2 XO700.4(VCC)
NetC700_1: C700.1 C702.1 C703.1 FB700.2 IC700.8(VCC_OUT) IC700.11(VCC_OUT)
NetC704_1: C704.1 C705.1 FB701.1 IC700.5(VCC1_PLL)
NetC706_1: C706.1 C707.1 C708.1 C709.1 FB702.1 IC700.39(VCC2_PLL) IC700.42(VCC2_PLL)
NetC710_1: C710.1 C711.1 C712.1 C713.1 FB703.2 IC700.18(VCC_OUT) IC700.21(VCC_OUT)
NetC714_1: C714.1 C715.1 FB704.1 IC700.47(VCC_IN_PRI)
NetC716_1: C716.1 C717.1 FB706.1 IC700.1(VCC_IN_SEC)
NetC720_1: C720.1 C721.1 FB707.1 IC700.44(VCC_AUXIN)
NetC722_1: C722.1 C723.1 C726.1 C727.1 FB705.2 IC700.26(VCC_OUT) IC700.29(VCC_OUT) IC700.32(VCC_OUT)
NetC724_1: C724.1 C725.1 C728.1 C749.1 FB709.1 IC701.10(VCC) IC701.28(VCC)
NetC729_1: C729.1 C730.1 FB708.1 IC700.34(VCC_VCO) IC700.35(VCC_VCO)
NetC731_1: C731.1 C740.1 C741.1 FB710.1 IC701.2(VCCOA) IC701.5(VCCOA)
NetC732_1: C732.1 IC700.48(VBB)
NetC733_1: C733.1 IC700.38(REG_CAP2)
NetC734_1: C734.1 IC700.4(REG_CAP1)
NetC735_1: C735.1 C736.2 IC700.41(EXT_LFN)
NetC735_2: C735.2 R703.2
NetC736_1: C736.1 IC700.40(EXT_LFP) R703.1
NetC737_1: C737.1 R726.1 XO700.3(OUT)
NetC742_1: C742.1 C743.1 C744.1 FB711.1 IC701.20(VCCOB) IC701.23(VCCOB)
NetC745_1: C745.1 IC701.30(VCCOC)
NetC747_1: C747.1 R726.2
NetC747_2: C747.2 IC701.27(CLKin1_P) R729.2
NetC748_1: C748.1 IC701.26(CLKin1_N)
NetD700_A: D700.A R702.1
NetFB710_2: FB710.2 R716.1 R717.1
NetFB711_2: FB711.2 R718.1 R719.1
NetIC400_29: IC700.14(~{SYNC}) ; port CLK_SYNC
NetIC400_30: IC700.31(REF_SEL) ; port CLK_REFSEL
NetIC400_31: IC700.12(~{PD}) ; port CLK_PD
NetIC400_45: IC700.22(SPI_MISO) ; port SPI_CLK_GEN.MISO
NetIC400_47: R700.1 ; port SPI_CLK_GEN.MOSI
NetIC400_48: IC700.24(SPI_CLK) ; port SPI_CLK_GEN.CLK
NetIC400_49: IC700.25(SPI_LE) ; port SPI_CLK_GEN.LE
NetIC400_61: IC701.32(CLKout_TYPE1) ; port CLK_BUF_CTL.CLKout_TYPE1
NetIC400_68: IC701.9(CLKout_TYPE0) ; port CLK_BUF_CTL.CLKout_TYPE0
NetIC400_69: IC701.16(CLKin_SEL1) ; port CLK_BUF_CTL.CLKin_SEL1
NetIC400_70: IC701.13(CLKin_SEL0) ; port CLK_BUF_CTL.CLKin_SEL0
NetIC700_2: IC700.2(SEC_REF-) R721.2
NetIC700_13: IC700.13(AUX_OUT) TP700.1
NetIC700_23: IC700.23(SPI_MOSI) R700.2
NetIC700_30: IC700.30(TESTOUTA) R701.1
NetIC700_37: IC700.37(PLL_LOCK) R702.2
NetIC700_43: IC700.43(AUX_IN) Q700.1
NetIC701_11: IC701.11(OSCin) R730.2
NetR723_2: R723.2 XO700.1(OE)

Not connected (* = marked no-connect by the designer): IC700 33(TEST_MODE); IC701 6(CLKoutA1_P)* 7(CLKoutA1_N)* 12(OSCout)* 21(CLKoutB0_N)* 22(CLKoutB0_P)* 29(REFout)*

### Layout directives
differential pair: CLK_ADC_N, CLK_ADC_P, CLK_DAC_N, CLK_DAC_P, CLK_EXT_BUF_N, CLK_EXT_BUF_P, CLK_EXT_N, CLK_EXT_OUTA_N, CLK_EXT_OUTA_P, CLK_EXT_OUTB_N, CLK_EXT_OUTB_P, CLK_EXT_P, CLK_FPGA_N, CLK_FPGA_P, CLK_REF_EXT_N, CLK_REF_EXT_P, CLK_REF_PRI_N, CLK_REF_PRI_P, DAC_OSTR_N, DAC_OSTR_P

### Notes on the sheet
- Title
- Size:
- Date:
- A3
- Number:
- Time:
- Revision:
- Sheet
- of
- File:

### Library data of the parts
C155 C700 C702-C749 = C
C701 = ELCO: EEH-ZA1E101XP
D700 = LED SMD: WURTH 150060VS75000
FB700-FB711 L700 = L
IC700 = CDCE62005: Five/Ten Output Clock Generator/Jitter Cleaner With Integrated Dual VCOs
IC701 = LMK00304: 3-GHz 4-Output Differential Clock Buffer/Level Translator
Q700 = CRYSTAL: XX MHz
R700-R730 = R
TP700 = TESTPOINT: pin to pad: 1>0
XO700 = OSZILLATOR_4P SMD: AST3TQ-10.00MHz-1